# Altium project Sampler.PrjPCB (part 1 of 3)
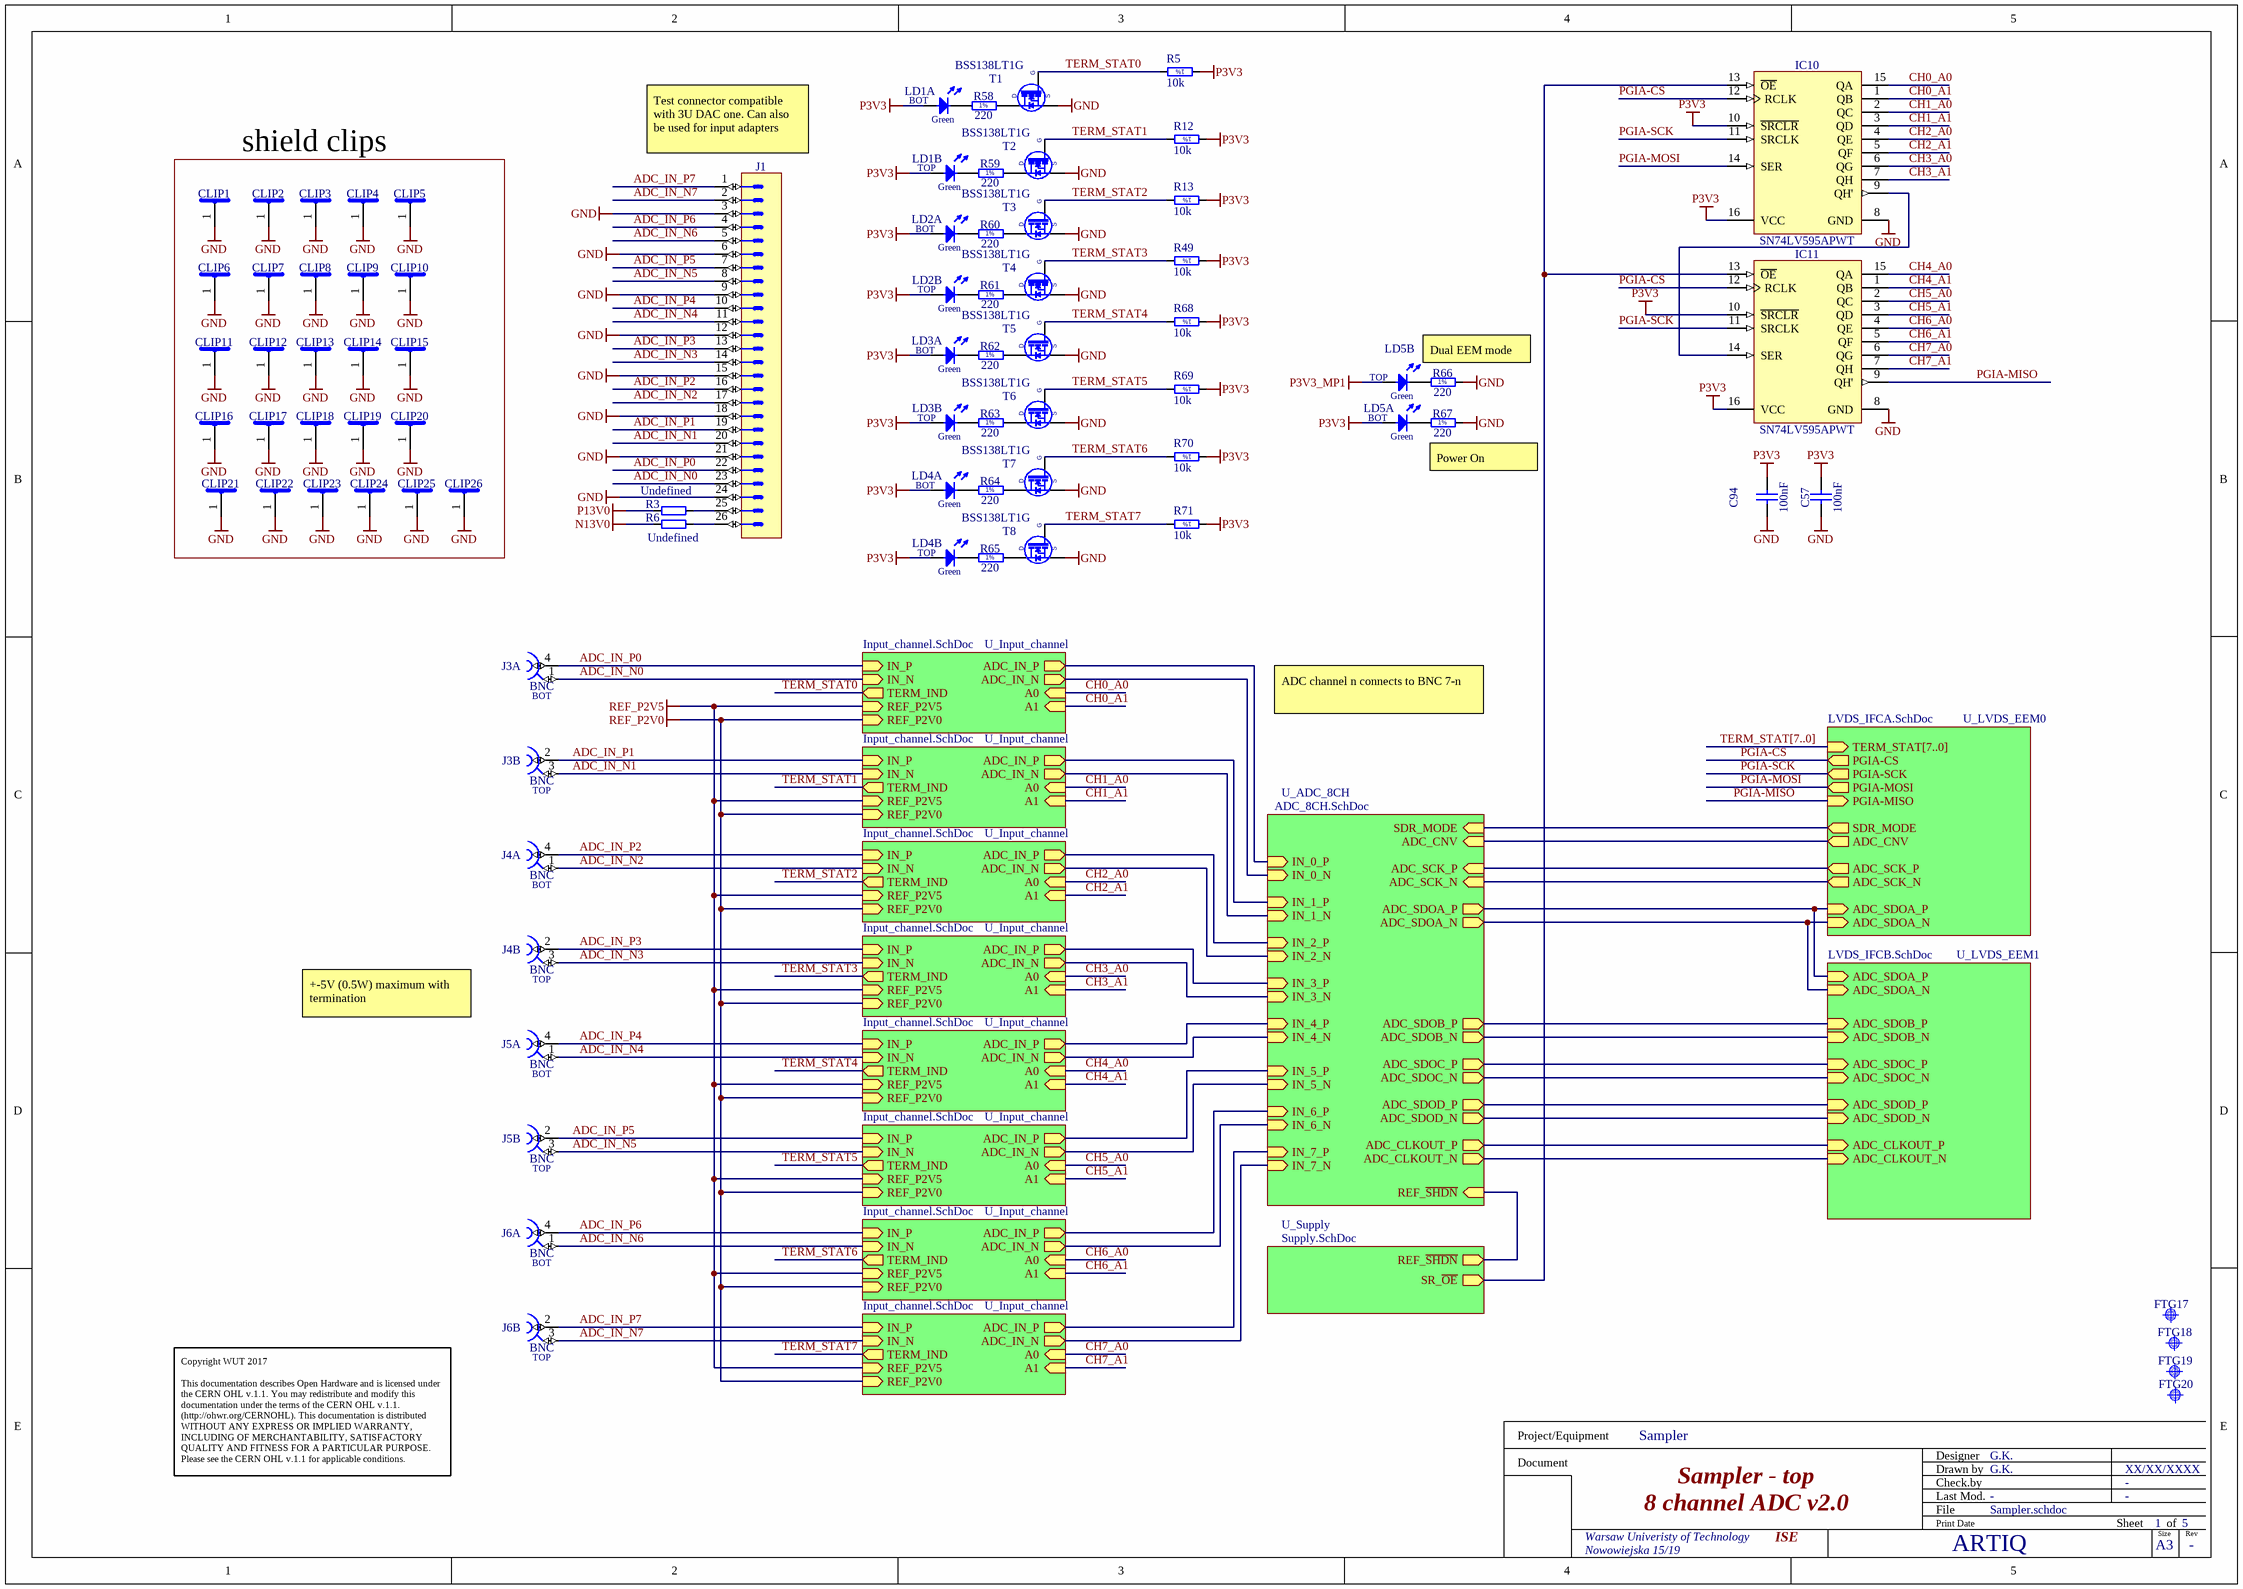
[diagram p0: Sampler.schdoc]
6 sheets, 530 parts. Net scope: hierarchical (ports join the sheet entries above them; power ports are global).
Board file: Sampler.PCBDOC
Sheets:
  Sampler.schdoc
    U_ADC_8CH = ADC_8CH.SchDoc
    U_LVDS_EEM0 = LVDS_IFCA.SchDoc
    U_Supply = Supply.SchDoc
    U_LVDS_EEM1 = LVDS_IFCB.SchDoc
    U_Input_channel = Input_channel.SchDoc
    U_Input_channel = Input_channel.SchDoc
    U_Input_channel = Input_channel.SchDoc
    U_Input_channel = Input_channel.SchDoc
    U_Input_channel = Input_channel.SchDoc
    U_Input_channel = Input_channel.SchDoc
    U_Input_channel = Input_channel.SchDoc
    U_Input_channel = Input_channel.SchDoc

## Sheet Sampler.schdoc: Sampler - top
size 420 x 297 mm; Author: G.K.; CompanyName: WUT; DrawnBy: G.K.; Organization: CERN; Address1: Warsaw Univeristy of Technology; Address2: Nowowiejska 15/19; DocumentNumber: 1; Revision: -; SheetNumber: 1; SheetTotal: 5; EDA_Number: ARTIQ; Projet: Sampler; ModifiedBy: -; CreateDate: XX/XX/XXXX; CheckedDate: -; Title2: 8 channel ADC v2.0; DivGrp: ISE; Designer: G.K.; ModifiedDate: -; ProjectName: Sampler

### Parts
C57  100nF  [CAPC1608X87N]
C94  100nF  [CAPC1608X87N]
CLIP1  S1411-46R  [CLIP_HOLLAND-SHIELDING_LC]  (value not drawn)
CLIP2  S1411-46R  [CLIP_HOLLAND-SHIELDING_LC]  (value not drawn)
CLIP3  S1411-46R  [CLIP_HOLLAND-SHIELDING_LC]  (value not drawn)
CLIP4  S1411-46R  [CLIP_HOLLAND-SHIELDING_LC]  (value not drawn)
CLIP5  S1411-46R  [CLIP_HOLLAND-SHIELDING_LC]  (value not drawn)
CLIP6  S1411-46R  [CLIP_HOLLAND-SHIELDING_LC]  (value not drawn)
CLIP7  S1411-46R  [CLIP_HOLLAND-SHIELDING_LC]  (value not drawn)
CLIP8  S1411-46R  [CLIP_HOLLAND-SHIELDING_LC]  (value not drawn)
CLIP9  S1411-46R  [CLIP_HOLLAND-SHIELDING_LC]  (value not drawn)
CLIP10  S1411-46R  [CLIP_HOLLAND-SHIELDING_LC]  (value not drawn)
CLIP11  S1411-46R  [CLIP_HOLLAND-SHIELDING_LC]  (value not drawn)
CLIP12  S1411-46R  [CLIP_HOLLAND-SHIELDING_LC]  (value not drawn)
CLIP13  S1411-46R  [CLIP_HOLLAND-SHIELDING_LC]  (value not drawn)
CLIP14  S1411-46R  [CLIP_HOLLAND-SHIELDING_LC]  (value not drawn)
CLIP15  S1411-46R  [CLIP_HOLLAND-SHIELDING_LC]  (value not drawn)
CLIP16  S1411-46R  [CLIP_HOLLAND-SHIELDING_LC]  (value not drawn)
CLIP17  S1411-46R  [CLIP_HOLLAND-SHIELDING_LC]  (value not drawn)
CLIP18  S1411-46R  [CLIP_HOLLAND-SHIELDING_LC]  (value not drawn)
CLIP19  S1411-46R  [CLIP_HOLLAND-SHIELDING_LC]  (value not drawn)
CLIP20  S1411-46R  [CLIP_HOLLAND-SHIELDING_LC]  (value not drawn)
CLIP21  S1411-46R  [CLIP_HOLLAND-SHIELDING_LC]  (value not drawn)
CLIP22  S1411-46R  [CLIP_HOLLAND-SHIELDING_LC]  (value not drawn)
CLIP23  S1411-46R  [CLIP_HOLLAND-SHIELDING_LC]  (value not drawn)
CLIP24  S1411-46R  [CLIP_HOLLAND-SHIELDING_LC]  (value not drawn)
CLIP25  S1411-46R  [CLIP_HOLLAND-SHIELDING_LC]  (value not drawn)
CLIP26  S1411-46R  [CLIP_HOLLAND-SHIELDING_LC]  (value not drawn)
FTG17  Use only in PCB  [FIDUCIAL_TOP_C100-200]  (value not drawn)
FTG18  Use only in PCB  [FIDUCIAL_TOP_S100-200]  (value not drawn)
FTG19  Use only in PCB  [FIDUCIAL_TOP_S200-400]  (value not drawn)
FTG20  Use only in PCB  [FIDUCIAL_TOP_S100-200]  (value not drawn)
IC10  SN74LV595APWT  [SOP65P640X120-16N]
IC11  SN74LV595APWT  [SOP65P640X120-16N]
J1  Header 26  [3M_N2526-6002RB]  (value not drawn)
J3  BNC  [RENHOTEC_RHT-610-0049]  (parts A,B of 2)
J4  BNC  [RENHOTEC_RHT-610-0049]  (parts A,B of 2)
J5  BNC  [RENHOTEC_RHT-610-0049]  (parts A,B of 2)
J6  BNC  [RENHOTEC_RHT-610-0049]  (parts A,B of 2)
LD1  Green/Green  [LED_DIALIGHT_571-0122F]  (value not drawn)  (parts A,B of 2)
LD2  Green/Green  [LED_DIALIGHT_571-0122F]  (value not drawn)  (parts A,B of 2)
LD3  Green/Green  [LED_DIALIGHT_571-0122F]  (value not drawn)  (parts A,B of 2)
LD4  Green/Green  [LED_DIALIGHT_571-0122F]  (value not drawn)  (parts A,B of 2)
LD5  Green/Green  [LED_DIALIGHT_571-0122F]  (value not drawn)  (parts A,B of 2)
R3  Undefined  [RESC1608X55N]
R5  10k  [RESC1005X40N]
R6  Undefined  [RESC1608X55N]
R12  10k  [RESC1005X40N]
R13  10k  [RESC1005X40N]
R49  10k  [RESC1005X40N]
R58  220  [RESC1608X55N]
R59  220  [RESC1608X55N]
R60  220  [RESC1608X55N]
R61  220  [RESC1608X55N]
R62  220  [RESC1608X55N]
R63  220  [RESC1608X55N]
R64  220  [RESC1608X55N]
R65  220  [RESC1608X55N]
R66  220  [RESC1608X55N]
R67  220  [RESC1608X55N]
R68  10k  [RESC1005X40N]
R69  10k  [RESC1005X40N]
R70  10k  [RESC1005X40N]
R71  10k  [RESC1005X40N]
T1  BSS138LT1G  [SOT95P240X110-3N]
T2  BSS138LT1G  [SOT95P240X110-3N]
T3  BSS138LT1G  [SOT95P240X110-3N]
T4  BSS138LT1G  [SOT95P240X110-3N]
T5  BSS138LT1G  [SOT95P240X110-3N]
T6  BSS138LT1G  [SOT95P240X110-3N]
T7  BSS138LT1G  [SOT95P240X110-3N]
T8  BSS138LT1G  [SOT95P240X110-3N]

### Blocks framed on the sheet
shield clips: CLIP1-CLIP26

### Sub-sheets
U_ADC_8CH = ADC_8CH.SchDoc: IN_1_P (in), IN_2_P (in), IN_0_P (in), IN_3_P (in), IN_4_P (in), IN_5_P (in), IN_6_P (in), IN_7_P (in), IN_0_N (in), IN_1_N (in), IN_2_N (in), IN_3_N (in), IN_6_N (in), IN_7_N (in), IN_4_N (in), IN_5_N (in), ADC_SDOA_P (out), ADC_SDOA_N (out), ADC_SCK_P (in), ADC_SCK_N (in), ADC_CNV (in), ADC_SDOB_N (out), ADC_SDOB_P (out), ADC_SDOC_P (out), ADC_SDOC_N (out), ADC_SDOD_N (out), ADC_SDOD_P (out), ADC_CLKOUT_P (out), ADC_CLKOUT_N (out), SDR_MODE (in), REF_~{SHDN} (in)
U_Input_channel = Input_channel.SchDoc: IN_N (in), A0 (in), A1 (in), IN_P (in), TERM_IND (out), ADC_IN_N (out), ADC_IN_P (out), REF_P2V5 (in), REF_P2V0 (in)
U_Input_channel = Input_channel.SchDoc: IN_N (in), A0 (in), A1 (in), IN_P (in), TERM_IND (out), ADC_IN_N (out), ADC_IN_P (out), REF_P2V5 (in), REF_P2V0 (in)
U_Input_channel = Input_channel.SchDoc: IN_N (in), A0 (in), A1 (in), IN_P (in), TERM_IND (out), ADC_IN_N (out), ADC_IN_P (out), REF_P2V5 (in), REF_P2V0 (in)
U_Input_channel = Input_channel.SchDoc: IN_N (in), A0 (in), A1 (in), IN_P (in), TERM_IND (out), ADC_IN_N (out), ADC_IN_P (out), REF_P2V5 (in), REF_P2V0 (in)
U_Input_channel = Input_channel.SchDoc: IN_N (in), A0 (in), A1 (in), IN_P (in), TERM_IND (out), ADC_IN_N (out), ADC_IN_P (out), REF_P2V5 (in), REF_P2V0 (in)
U_Input_channel = Input_channel.SchDoc: IN_N (in), A0 (in), A1 (in), IN_P (in), TERM_IND (out), ADC_IN_N (out), ADC_IN_P (out), REF_P2V5 (in), REF_P2V0 (in)
U_Input_channel = Input_channel.SchDoc: IN_N (in), A0 (in), A1 (in), IN_P (in), TERM_IND (out), ADC_IN_N (out), ADC_IN_P (out), REF_P2V5 (in), REF_P2V0 (in)
U_Input_channel = Input_channel.SchDoc: IN_N (in), A0 (in), A1 (in), IN_P (in), TERM_IND (out), ADC_IN_N (out), ADC_IN_P (out), REF_P2V5 (in), REF_P2V0 (in)
U_LVDS_EEM0 = LVDS_IFCA.SchDoc: TERM_STAT[7..0] (in), PGIA-CS (out), PGIA-SCK (out), PGIA-MOSI (out), PGIA-MISO (in), ADC_SDOA_N (in), ADC_SDOA_P (in), ADC_SCK_N (out), ADC_SCK_P (out), ADC_CNV (out), SDR_MODE (out)
U_LVDS_EEM1 = LVDS_IFCB.SchDoc: ADC_SDOB_P (in), ADC_SDOB_N (in), ADC_SDOC_P (in), ADC_SDOC_N (in), ADC_SDOD_P (in), ADC_SDOD_N (in), ADC_CLKOUT_P (in), ADC_CLKOUT_N (in), ADC_SDOA_N (in), ADC_SDOA_P (in)
U_Supply = Supply.SchDoc: REF_~{SHDN} (out), SR_~{OE} (out)

### Nets
GND: C57.1 C94.1 CLIP1.1 CLIP2.1 CLIP3.1 CLIP4.1 CLIP5.1 CLIP6.1 CLIP7.1 CLIP8.1 CLIP9.1 CLIP10.1 CLIP11.1 CLIP12.1 CLIP13.1 CLIP14.1 CLIP15.1 CLIP16.1 CLIP17.1 CLIP18.1 CLIP19.1 CLIP20.1 CLIP21.1 CLIP22.1 CLIP23.1 CLIP24.1 CLIP25.1 CLIP26.1 IC10.8(GND) IC11.8(GND) J1.3 J1.6 J1.9 J1.12 J1.15 J1.18 J1.21 J1.24 R66.2 R67.2 T1.2(S) T2.2(S) T3.2(S) T4.2(S) T5.2(S) T6.2(S) T7.2(S) T8.2(S)
N13V0: R6.2
P3V3: C57.2 C94.2 IC10.10(~{SRCLR}) IC10.16(VCC) IC11.10(~{SRCLR}) IC11.16(VCC) LD1.2(A) LD1.4(A) LD2.2(A) LD2.4(A) LD3.2(A) LD3.4(A) LD4.2(A) LD4.4(A) LD5.2(A) R5.1 R12.1 R13.1 R49.1 R68.1 R69.1 R70.1 R71.1
P3V3_MP1: LD5.4(A)
P13V0: R3.2
REF_P2V0: sheet U_Input_channel/REF_P2V0, sheet U_Input_channel/REF_P2V0, sheet U_Input_channel/REF_P2V0, sheet U_Input_channel/REF_P2V0, sheet U_Input_channel/REF_P2V0, sheet U_Input_channel/REF_P2V0, sheet U_Input_channel/REF_P2V0, sheet U_Input_channel/REF_P2V0
REF_P2V5: sheet U_Input_channel/REF_P2V5, sheet U_Input_channel/REF_P2V5, sheet U_Input_channel/REF_P2V5, sheet U_Input_channel/REF_P2V5, sheet U_Input_channel/REF_P2V5, sheet U_Input_channel/REF_P2V5, sheet U_Input_channel/REF_P2V5, sheet U_Input_channel/REF_P2V5
ADC_CLKOUT_N: sheet U_ADC_8CH/ADC_CLKOUT_N, sheet U_LVDS_EEM1/ADC_CLKOUT_N
ADC_CLKOUT_P: sheet U_ADC_8CH/ADC_CLKOUT_P, sheet U_LVDS_EEM1/ADC_CLKOUT_P
ADC_IN_N0: J1.23 J3.1 ; sheet U_Input_channel/IN_N
ADC_IN_N1: J1.20 J3.3 ; sheet U_Input_channel/IN_N
ADC_IN_N2: J1.17 J4.1 ; sheet U_Input_channel/IN_N
ADC_IN_N3: J1.14 J4.3 ; sheet U_Input_channel/IN_N
ADC_IN_N4: J1.11 J5.1 ; sheet U_Input_channel/IN_N
ADC_IN_N5: J1.8 J5.3 ; sheet U_Input_channel/IN_N
ADC_IN_N6: J1.5 J6.1 ; sheet U_Input_channel/IN_N
ADC_IN_N7: J1.2 J6.3 ; sheet U_Input_channel/IN_N
ADC_IN_P0: J1.22 J3.4 ; sheet U_Input_channel/IN_P
ADC_IN_P1: J1.19 J3.2 ; sheet U_Input_channel/IN_P
ADC_IN_P2: J1.16 J4.4 ; sheet U_Input_channel/IN_P
ADC_IN_P3: J1.13 J4.2 ; sheet U_Input_channel/IN_P
ADC_IN_P4: J1.10 J5.4 ; sheet U_Input_channel/IN_P
ADC_IN_P5: J1.7 J5.2 ; sheet U_Input_channel/IN_P
ADC_IN_P6: J1.4 J6.4 ; sheet U_Input_channel/IN_P
ADC_IN_P7: J1.1 J6.2 ; sheet U_Input_channel/IN_P
ADC_SCK_N: sheet U_ADC_8CH/ADC_SCK_N, sheet U_LVDS_EEM0/ADC_SCK_N
ADC_SCK_P: sheet U_ADC_8CH/ADC_SCK_P, sheet U_LVDS_EEM0/ADC_SCK_P
ADC_SDOA_N: sheet U_ADC_8CH/ADC_SDOA_N, sheet U_LVDS_EEM0/ADC_SDOA_N, sheet U_LVDS_EEM1/ADC_SDOA_N
ADC_SDOA_P: sheet U_ADC_8CH/ADC_SDOA_P, sheet U_LVDS_EEM0/ADC_SDOA_P, sheet U_LVDS_EEM1/ADC_SDOA_P
ADC_SDOB_N: sheet U_ADC_8CH/ADC_SDOB_N, sheet U_LVDS_EEM1/ADC_SDOB_N
ADC_SDOB_P: sheet U_ADC_8CH/ADC_SDOB_P, sheet U_LVDS_EEM1/ADC_SDOB_P
ADC_SDOC_N: sheet U_ADC_8CH/ADC_SDOC_N, sheet U_LVDS_EEM1/ADC_SDOC_N
ADC_SDOC_P: sheet U_ADC_8CH/ADC_SDOC_P, sheet U_LVDS_EEM1/ADC_SDOC_P
ADC_SDOD_N: sheet U_ADC_8CH/ADC_SDOD_N, sheet U_LVDS_EEM1/ADC_SDOD_N
ADC_SDOD_P: sheet U_ADC_8CH/ADC_SDOD_P, sheet U_LVDS_EEM1/ADC_SDOD_P
CH0_A0: IC10.15(QA) ; sheet U_Input_channel/A0
CH0_A1: IC10.1(QB) ; sheet U_Input_channel/A1
CH1_A0: IC10.2(QC) ; sheet U_Input_channel/A0
CH1_A1: IC10.3(QD) ; sheet U_Input_channel/A1
CH2_A0: IC10.4(QE) ; sheet U_Input_channel/A0
CH2_A1: IC10.5(QF) ; sheet U_Input_channel/A1
CH3_A0: IC10.6(QG) ; sheet U_Input_channel/A0
CH3_A1: IC10.7(QH) ; sheet U_Input_channel/A1
CH4_A0: IC11.15(QA) ; sheet U_Input_channel/A0
CH4_A1: IC11.1(QB) ; sheet U_Input_channel/A1
CH5_A0: IC11.2(QC) ; sheet U_Input_channel/A0
CH5_A1: IC11.3(QD) ; sheet U_Input_channel/A1
CH6_A0: IC11.4(QE) ; sheet U_Input_channel/A0
CH6_A1: IC11.5(QF) ; sheet U_Input_channel/A1
CH7_A0: IC11.6(QG) ; sheet U_Input_channel/A0
CH7_A1: IC11.7(QH) ; sheet U_Input_channel/A1
IN_0_N: sheet U_ADC_8CH/IN_0_N, sheet U_Input_channel/ADC_IN_N
IN_0_P: sheet U_ADC_8CH/IN_0_P, sheet U_Input_channel/ADC_IN_P
IN_1_N: sheet U_ADC_8CH/IN_1_N, sheet U_Input_channel/ADC_IN_N
IN_1_P: sheet U_ADC_8CH/IN_1_P, sheet U_Input_channel/ADC_IN_P
IN_2_N: sheet U_ADC_8CH/IN_2_N, sheet U_Input_channel/ADC_IN_N
IN_2_P: sheet U_ADC_8CH/IN_2_P, sheet U_Input_channel/ADC_IN_P
IN_3_N: sheet U_ADC_8CH/IN_3_N, sheet U_Input_channel/ADC_IN_N
IN_3_P: sheet U_ADC_8CH/IN_3_P, sheet U_Input_channel/ADC_IN_P
IN_4_N: sheet U_ADC_8CH/IN_4_N, sheet U_Input_channel/ADC_IN_N
IN_4_P: sheet U_ADC_8CH/IN_4_P, sheet U_Input_channel/ADC_IN_P
IN_5_N: sheet U_ADC_8CH/IN_5_N, sheet U_Input_channel/ADC_IN_N
IN_5_P: sheet U_ADC_8CH/IN_5_P, sheet U_Input_channel/ADC_IN_P
IN_6_N: sheet U_ADC_8CH/IN_6_N, sheet U_Input_channel/ADC_IN_N
IN_6_P: sheet U_ADC_8CH/IN_6_P, sheet U_Input_channel/ADC_IN_P
IN_7_N: sheet U_ADC_8CH/IN_7_N, sheet U_Input_channel/ADC_IN_N
IN_7_P: sheet U_ADC_8CH/IN_7_P, sheet U_Input_channel/ADC_IN_P
PGIA-CS: IC10.12(RCLK) IC11.12(RCLK) ; sheet U_LVDS_EEM0/PGIA-CS
PGIA-MISO: IC11.9(QH') ; sheet U_LVDS_EEM0/PGIA-MISO
PGIA-MOSI: IC10.14(SER) ; sheet U_LVDS_EEM0/PGIA-MOSI
PGIA-SCK: IC10.11(SRCLK) IC11.11(SRCLK) ; sheet U_LVDS_EEM0/PGIA-SCK
TERM_STAT0: R5.2 T1.1(G) ; sheet U_Input_channel/TERM_IND
TERM_STAT1: R12.2 T2.1(G) ; sheet U_Input_channel/TERM_IND
TERM_STAT2: R13.2 T3.1(G) ; sheet U_Input_channel/TERM_IND
TERM_STAT3: R49.2 T4.1(G) ; sheet U_Input_channel/TERM_IND
TERM_STAT4: R68.2 T5.1(G) ; sheet U_Input_channel/TERM_IND
TERM_STAT5: R69.2 T6.1(G) ; sheet U_Input_channel/TERM_IND
TERM_STAT6: R70.2 T7.1(G) ; sheet U_Input_channel/TERM_IND
TERM_STAT7: R71.2 T8.1(G) ; sheet U_Input_channel/TERM_IND
NetD6_1: sheet U_ADC_8CH/REF_~{SHDN}, sheet U_Supply/REF_~{SHDN}
NetIC2_24: sheet U_ADC_8CH/ADC_CNV, sheet U_LVDS_EEM0/ADC_CNV
NetIC10_9: IC10.9(QH') IC11.14(SER)
NetIC10_13: IC10.13(~{OE}) IC11.13(~{OE}) ; sheet U_Supply/SR_~{OE}
NetIC24_5: sheet U_ADC_8CH/SDR_MODE, sheet U_LVDS_EEM0/SDR_MODE
NetJ1_25: J1.25 R3.1
NetJ1_26: J1.26 R6.1
NetLD1_1: LD1.1(C) R58.1
NetLD1_3: LD1.3(C) R59.1
NetLD2_1: LD2.1(C) R60.1
NetLD2_3: LD2.3(C) R61.1
NetLD3_1: LD3.1(C) R62.1
NetLD3_3: LD3.3(C) R63.1
NetLD4_1: LD4.1(C) R64.1
NetLD4_3: LD4.3(C) R65.1
NetLD5_1: LD5.1(C) R67.1
NetLD5_3: LD5.3(C) R66.1
NetR58_2: R58.2 T1.3(D)
NetR59_2: R59.2 T2.3(D)
NetR60_2: R60.2 T3.3(D)
NetR61_2: R61.2 T4.3(D)
NetR62_2: R62.2 T5.3(D)
NetR63_2: R63.2 T6.3(D)
NetR64_2: R64.2 T7.3(D)
NetR65_2: R65.2 T8.3(D)

### Buses and harness runs
bus TERM_STAT[7..0] = sheet U_LVDS_EEM0/TERM_STAT[7..0]

### Notes on the sheet
- (near J1) Test connector compatible with 3U DAC one. Can also be used for input adapters
- Dual EEM mode
- Power On
- ADC channel n connects to BNC 7-n
- +-5V (0.5W) maximum with termination
- Copyright WUT 2017
  This documentation describes Open Hardware and is licensed under the CERN OHL v.1.1. You may redistribute and modify this documentation under the terms of the CERN OHL v.1.1. (http://ohwr.org/CERNOHL). This documentation is distributed WITHOUT ANY EXPRESS OR IMPLIED WARRANTY, INCLUDING OF MERCHANTABILITY, SATISFACTORY QUALITY AND FITNESS FOR A PARTICULAR PURPOSE. Please see the CERN OHL v.1.1 for applicable conditions.
- Project/Equipment
- Document
- Designer
- Drawn by
- Check.by
- File
- Last Mod.
- Print Date
- Sheet
- Size
- A3
- of
- Rev
- (in symbol CON_BNC_DUAL, part A) BOT
- (in symbol CON_BNC_DUAL, part B) TOP
- (in symbol LED_DIALIGHT_571-0122F, part A) BOT; Green
- (in symbol LED_DIALIGHT_571-0122F, part B) TOP; Green
- (in symbol R0402_10K_1%_0.0625W_100PPM) 1%
- (in symbol R0603_220R_1%_0.1W_100PPM) 1%

### Library data of the parts
C57 C94 = CC0603_100NF_50V_10%_X7R: Non-polarised capacitor; Part Description: SMD Multilayer Chip Ceramic Capacitor; Manufacturer: GENERIC; Manufacturer1 Part Number: 223858615649; Voltage: 50V; TC: X7R; Tolerance: ±10%; Part Number: CC0603_100NF_50V_10%_X7R; Component Kind: Standard; Component Type: Standard; Pin Count: 2; Value: 100nF; Status: Preferred; Manufacturer Part Number: CC0603_100NF_50V_10%_X7R; Case: 0603; Mounted: Yes; Socket: No; SMD: Yes; Sense: No; Manufacturer1 Example: PHYCOMP; Manufacturer1 ComponentHeight: 0.87mm; HelpURL: \\cern.ch\dfs\Applications\Altium\Datasheets\CC0603_X7R_PHYCOMP.pdf; Author: CERN DEM JLC; CreateDate: 03.12.2007; LatestRevisionDate: 03.12.2007
CLIP1-CLIP26 = SHIELD_CLIP: Surface Mount Clip for PCB Screening Covers; Part Description: Surface Mount Clip for PCB Screening Covers, 1500 Serie; Manufacturer: HARWIN; PressFit: No; Table: Metal Screening Box; Part Number: S1411-46R; Component Kind: Standard; Component Type: Standard; Pin Count: 1; PackageDescription: Surface Mount Clip for PCB Screening Covers, 1500 Serie; Mounted: Yes; Socket: No; SMD: Yes; Status: None; Manufacturer Part Number: S1411-46R; ComponentHeight: 3.5mm; HelpURL: \\cern.ch\dfs\Applications\Altium\Datasheets\CLIP_HOLLAND-SHIELDING_LC.pdf; Author: CERN DEM JLC; CreateDate: 2013-06-25; LatestRevisionDate: 2013-06-25
FTG17 = FIDUCIAL_TARGET_C100-200: Fiducial Target; Part Description: Round Fiducial Target, Top Layer, 1.0mm, Top Solder 2.0mm, Keepout =2.0mm; Mounted: No; Part Number: FIDUCIAL_TARGET_C100-200; Component Kind: Standard (No BOM); Component Type: Standard (No BOM); Pin Count: 1; Family: Fiducial; Socket: No; SMD: Yes; Sense: No; Status: None; ComponentHeight: 0mm; HelpURL: Undefined; Author: CERN DEM JLC; CreateDate: 09.02.2010; LatestRevisionDate: 04.04.2012; PackageDescription: Round Fiducial Target, Top Layer, 1.0mm, Top Solder 2.0mm, Keepout =2.0mm
FTG18 FTG20 = FIDUCIAL_TARGET_S100-200: Fiducial Target; Part Description: Square Fiducial Target, Top Layer, 1.0mm, Top Solder 2.0mm, Keepout =2.0mm; Mounted: No; Part Number: FIDUCIAL_TARGET_S100-200; Component Kind: Standard (No BOM); Component Type: Standard (No BOM); Pin Count: 1; Family: Fiducial; Socket: No; SMD: Yes; Sense: No; Status: None; ComponentHeight: 0mm; HelpURL: Undefined; Author: CERN DEM JLC; CreateDate: 09.02.2010; LatestRevisionDate: 04.04.2012; PackageDescription: Square Fiducial Target, Top Layer, 1.0mm, Top Solder 2.0mm, Keepout =2.0mm
FTG19 = FIDUCIAL_TARGET_S200-400: Fiducial Target; Part Description: Square Fiducial Target, Top Layer, 2.0mm, Top Solder 4.0mm, Keepout =4.0mm; Mounted: No; Part Number: FIDUCIAL_TARGET_S200-400; Component Kind: Standard (No BOM); Component Type: Standard (No BOM); Pin Count: 1; Family: Fiducial; Socket: No; SMD: Yes; Sense: No; Status: None; ComponentHeight: 0mm; HelpURL: Undefined; Author: CERN DEM JLC; CreateDate: 02.06.2008; LatestRevisionDate: 04.04.2012; PackageDescription: Square Fiducial Target, Top Layer, 2.0mm, Top Solder 4.0mm, Keepout =4.0mm
IC10 IC11 = SN74LV595APWT: 8-Bit Shift Register With 3-State Output Register; Manufacturer: TEXAS INSTRUMENTS; PressFit: No; Bonding: No; Part Number: SN74LV595APWT; Component Kind: Standard; Component Type: Standard; Device: SN74LV595APWT; PackageDescription: SOP, 0.65mm pitch; 16 pin, 4.40mm W X 5.00mm L X 1.20mm H body IPC Medium Density; Part Description: 8-Bit Shift Register With 3-State Output Register; Manufacturer Part Number: SN74LV595APWT; Pin Count: 16; Case: TSSOP16; Mounted: Yes; Socket: No; SMD: Yes; Sense: No; ComponentHeight: 1.2mm; Author: CERN DEM JLC; HelpURL: \\cern.ch\dfs\Applications\Altium\Datasheets\SN74LV595APWT.pdf; CreateDate: 10.05.2012; LatestRevisionDate: 10.05.2012
J1 = 3M_N2526-6002RB: Connector 26 Male; Part Description: 26 Contacts - Straight .100'' x .100'' Low Profile Four-Wall Header, 2500 Series; Manufacturer: 3M; PressFit: No; Part Number: 3M_N2526-6002RB; Component Kind: Standard; Component Type: Standard; Pin Count: 26; Family: Header 26; Mounted: Yes; Socket: No; SMD: No; Sense: No; Status: None; Manufacturer Part Number: N2526-6002RB; ComponentHeight: 10.03mm; HelpURL: \\cern.ch\dfs\Applications\Altium\Datasheets\3M_N2526-6002RB.pdf; Author: CERN DEM JLC; CreateDate: 11.02.2009; LatestRevisionDate: 11.08.2009
J3-J6 = CON_BNC_DUAL: Dual Right Angle 50 Ohm BNC Jack, White Valox Case; Manufacturer: RENHOTEC; Manufacturer Part Number: RHT-610-0049; PressFit: No; Part Number: RENHOTEC_RHT-610-0049; Component Kind: Standard; Component Type: Standard; Pin Count: 6; Family: BNC; Mounted: Yes; Socket: No; SMD: No; Sense: No; Status: None; Part Description: Dual Right Angle 50 Ohm BNC Jack, White Valox Case; ComponentHeight: 29.3mm; HelpURL: \\cern.ch\dfs\Applications\Altium\Datasheets\BOMAR_364A2595.pdf; Author: GK; CreateDate: 09.04.2013; LatestRevisionDate: 09.04.2013
LD1-LD5 = LED_DIALIGHT_571-0122F: LED x2 Green 1C2A-BOT_3C4A-TOP; Part Description: Dual 2mm Green LEDs CBI® Circuit Board Indicator (Without positioning pins); PressFit: No; Bonding: No; Part Number: LED_DIALIGHT_571-0122F; Component Kind: Standard; Component Type: Standard; Color: Green/Green; PackageDescription: 2x 2mm Red LED PCB Edge Mounting (Without positioning pins) DIALIGHT 571 Serie; Manufacturer: DIALIGHT; Manufacturer Part Number: 571-0122F; Pin Count: 4; Mounted: Yes; Socket: No; SMD: No; Sense: No; ComponentHeight: 8.6mm; HelpURL: \\cern.ch\dfs\Applications\Altium\Datasheets\LED_DIALIGHT_571-0122F.pdf; Author: CERN DEM JLC; CreateDate: 09.11.2009; LatestRevisionDate: 17.03.2010
R3 R6 = R0603_NO-VALUE: Resistor; Part Description: Reserved Footprint For a 0603 (1608) Chip Resistor; Mounted: No; Part Number: R0603_NO-VALUE; Component Kind: Standard; Component Type: Standard; Pin Count: 2; Value: Undefined; Status: None; Manufacturer: Undefined; Manufacturer Part Number: R0603_NO-VALUE; Case: 0603; Sense: No; Socket: No; SMD: Yes; Manufacturer1 Example: Undefined; Manufacturer1 Part Number: Undefined; Manufacturer1 ComponentHeight: Undefined; HelpURL: Undefined; Author: CERN DEM JLC; CreateDate: 03.12.2007; LatestRevisionDate: 13.03.2008
R5 R12 R13 R49 R68-R71 = R0402_10K_1%_0.0625W_100PPM: Resistor - 1%; Part Description: General Purpose Thick Film Chip Resistor; Manufacturer: GENERIC; Manufacturer1 Part Number: 232270671003L; TC: ±100ppm/°C; Part Number: R0402_10K_1%_0.0625W_100PPM; Component Kind: Standard; Component Type: Standard; Pin Count: 2; Value: 10k; Status: Not recommended; Power: 0.0625W; Tolerance: ±1%; Manufacturer Part Number: R0402_10K_1%_0.0625W_100PPM; Case: 0402; Mounted: Yes; Sense: No; Socket: No; SMD: Yes; Manufacturer1 Example: YAGEO PHYCOMP; Manufacturer1 ComponentHeight: 0.4mm; HelpURL: \\cern.ch\dfs\Applications\Altium\Datasheets\R0402_Phycomp_RC0402.pdf; Author: CERN DEM JLC; CreateDate: 03.12.2007; LatestRevisionDate: 17.10.2012
R58-R67 = R0603_220R_1%_0.1W_100PPM: Resistor - 1%; Part Description: General Purpose Thick Film Chip Resistor; Manufacturer: GENERIC; Manufacturer1 Part Number: NRC06F2200TRF; Power: 0.1W; TC: ±100ppm/°C; Part Number: R0603_220R_1%_0.1W_100PPM; Component Kind: Standard; Component Type: Standard; Pin Count: 2; Value: 220; Status: Preferred; Tolerance: ±1%; Manufacturer Part Number: R0603_220R_1%_0.1W_100PPM; Case: 0603; Mounted: Yes; Sense: No; Socket: No; SMD: Yes; Manufacturer1 Example: NIC COMPONENT; Manufacturer1 ComponentHeight: 0.55mm; HelpURL: \\cern.ch\dfs\Applications\Altium\Datasheets\R0603_NIC_NRC.pdf; Author: CERN DEM JLC; CreateDate: 03.12.2007; LatestRevisionDate: 13.03.2008
T1-T8 = BSS138LT1G: N-CHANNEL MOSFET WITH DIODE; Part Description: 50V 200mA N-Channel Enhancement Mode Field-Effect Transistor; Manufacturer: ON SEMICONDUCTOR; PressFit: No; Bonding: No; Part Number: BSS138LT1G; Component Kind: Standard; Component Type: Standard; Device: BSS138LT1G; PackageDescription: SOT23 3-Leads, Pitch 0.95mm - Body 1.4x3mm, IPC Medium Density; Manufacturer Part Number: BSS138LT1G; Pin Count: 3; Case: SOT23-3; Mounted: Yes; Socket: No; SMD: Yes; Sense: No; ComponentHeight: 1.11mm; HelpURL: \\cern.ch\dfs\Applications\Altium\Datasheets\BSS138LT1G.pdf; Author: CERN DEM JLC; CreateDate: 23.03.2009; LatestRevisionDate: 23.03.2009

## Sheet ADC_8CH.SchDoc: ADC + reference
size 420 x 297 mm; Author: G.K.; CompanyName: WUT; DrawnBy: G.K.; Organization: CERN; Address1: Warsaw Univeristy of Technology; Address2: Nowowiejska 15/19; DocumentNumber: 2; Revision: -; SheetNumber: 2; SheetTotal: 5; EDA_Number: ARTIQ; Projet: Sampler; ModifiedBy: -; CreateDate: XX/XX/XXXX; CheckedDate: -; Title2: v2.0; DivGrp: ISE; Designer: G.K.; ModifiedDate: -; ProjectName: Sampler
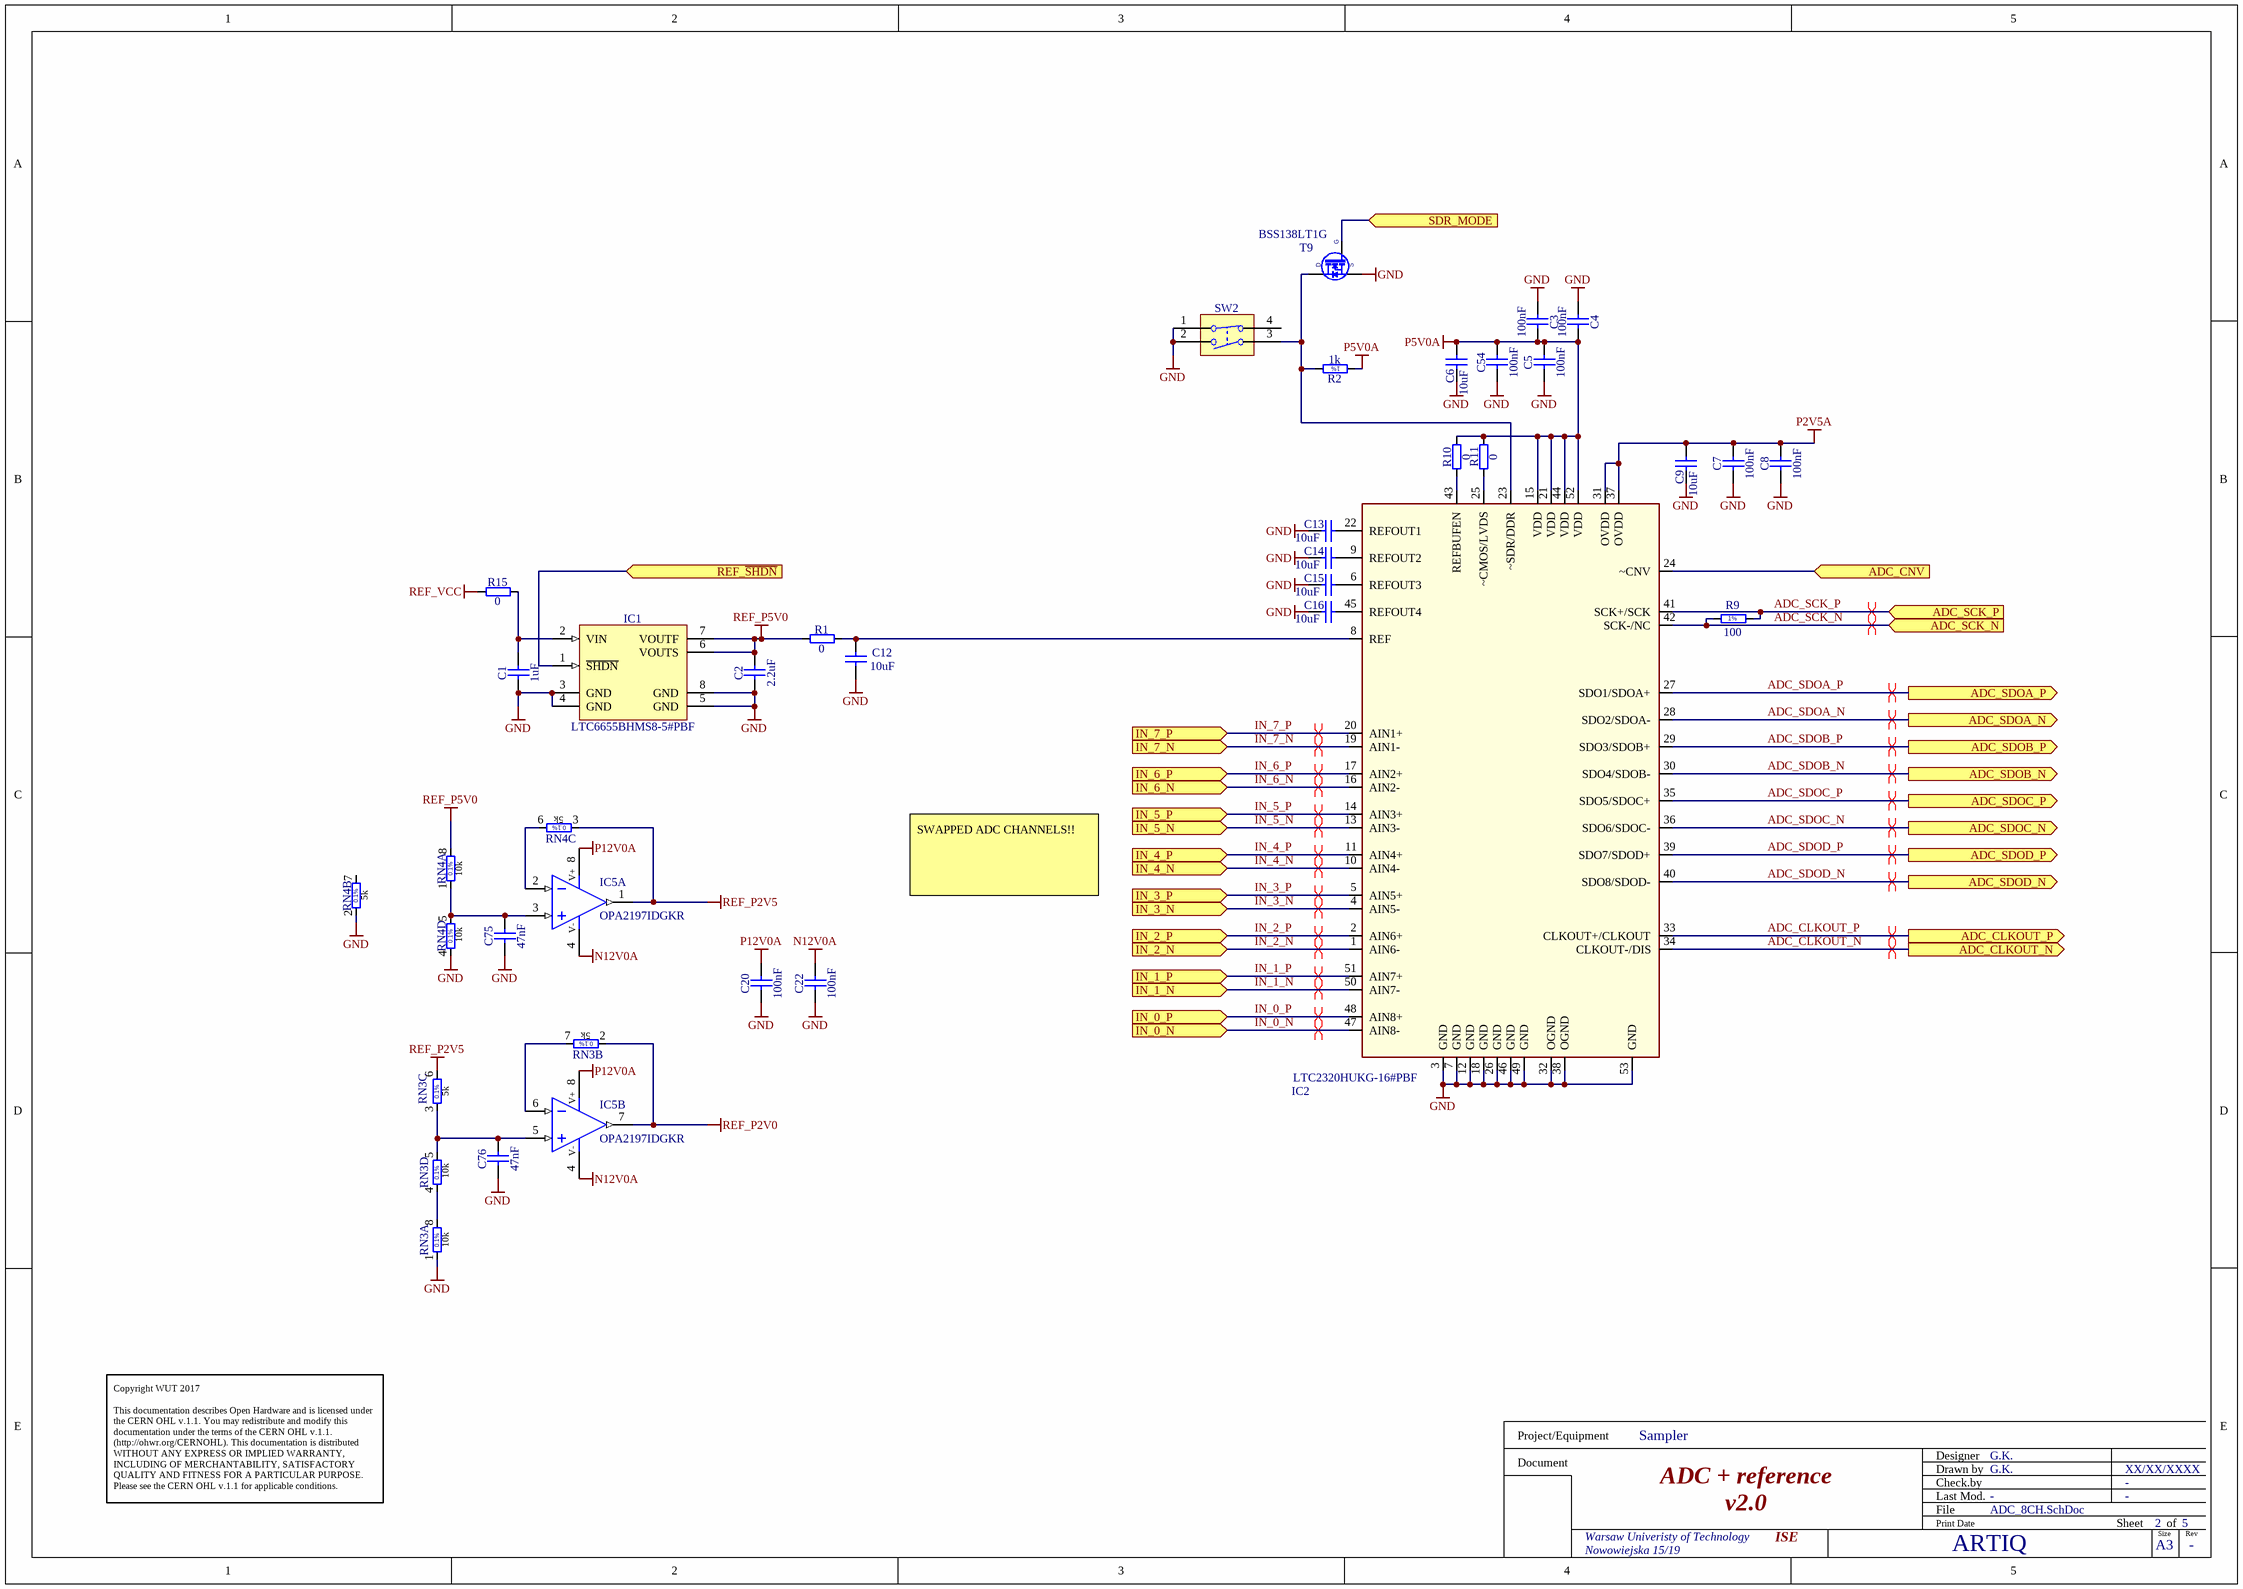
[diagram p1: ADC_8CH.SchDoc]

### Parts
C1  1uF  [CAPC1608X87N]
C2  2.2uF  [CAPC1608X87N]
C3  100nF  [CAPC1608X87N]
C4  100nF  [CAPC1608X87N]
C5  100nF  [CAPC1608X87N]
C6  10uF  [CAPC2012X95N]
C7  100nF  [CAPC1608X87N]
C8  100nF  [CAPC1608X87N]
C9  10uF  [CAPC2012X95N]
C12  10uF  [CAPC2012X95N]
C13  10uF  [CAPC2012X95N]
C14  10uF  [CAPC2012X95N]
C15  10uF  [CAPC2012X95N]
C16  10uF  [CAPC2012X95N]
C20  100nF  [CAPC1005X55N]
C22  100nF  [CAPC1005X55N]
C54  100nF  [CAPC1608X87N]
C75  47nF  [CAPC2012X135N]
C76  47nF  [CAPC2012X135N]
IC1  LTC6655BHMS8-5#PBF  [SOP65P490X110-8N]
IC2  LTC2320HUKG-16#PBF  [QFN50P700X800X80_HS-53M]
IC5  OPA2197IDGKR  [SOP65P490X110-8N]  (parts A,B of 2)
R1  0  [RESC1005X40N]
R2  1k  [RESC1608X55N]
R9  100  [RESC1005X40N]
R10  0  [RESC1005X40N]
R11  0  [RESC1005X40N]
R15  0  [RESC1005X40N]
RN3  10k 5K 5K 10K  [SOIC127P600X175-8N]  (value not drawn)  (parts A,B,C,D of 4)
RN4  10k 5K 5K 10K  [SOIC127P600X175-8N]  (value not drawn)  (parts A,B,C,D of 4)
SW2  Switch  [SW_CTS_204-121ST]  (value not drawn)
T9  BSS138LT1G  [SOT95P240X110-3N]

### Ports
ADC_CLKOUT_N (out), ADC_CLKOUT_P (out), ADC_CNV (in), ADC_SCK_N (in), ADC_SCK_P (in), ADC_SDOA_N (out), ADC_SDOA_P (out), ADC_SDOB_N (out), ADC_SDOB_P (out), ADC_SDOC_N (out), ADC_SDOC_P (out), ADC_SDOD_N (out), ADC_SDOD_P (out), IN_0_N (in), IN_0_P (in), IN_1_N (in), IN_1_P (in), IN_2_N (in), IN_2_P (in), IN_3_N (in), IN_3_P (in), IN_4_N (in), IN_4_P (in), IN_5_N (in), IN_5_P (in), IN_6_N (in), IN_6_P (in), IN_7_N (in), IN_7_P (in), REF_~{SHDN} (in), SDR_MODE (in)

### Nets
GND: C1.1 C2.1 C3.1 C4.1 C5.1 C6.1 C7.1 C8.1 C9.1 C12.1 C13.1 C14.1 C15.1 C16.1 C20.1 C22.1 C54.1 C75.1 C76.1 IC1.3(GND) IC1.4(GND) IC1.5(GND) IC1.8(GND) IC2.3(GND) IC2.7(GND) IC2.12(GND) IC2.18(GND) IC2.26(GND) IC2.32(OGND) IC2.38(OGND) IC2.46(GND) IC2.49(GND) IC2.53(GND) RN3.1 RN4.2 RN4.4 SW2.1 SW2.2 T9.2(S)
N12V0A: C22.2 IC5.4(V-)
P2V5A: C7.2 C8.2 C9.2 IC2.31(OVDD) IC2.37(OVDD)
P5V0A: C3.2 C4.2 C5.2 C6.2 C54.2 IC2.15(VDD) IC2.21(VDD) IC2.44(VDD) IC2.52(VDD) R2.1 R10.2 R11.2
P12V0A: C20.2 IC5.8(V+)
REF_P2V0: IC5.7(OUT) RN3.2
REF_P2V5: IC5.1(OUT) RN3.6 RN4.3
REF_P5V0: C2.2 IC1.6(VOUTS) IC1.7(VOUTF) R1.1 RN4.8
REF_VCC: R15.1
ADC_CLKOUT_N: IC2.34(CLKOUT-/DIS) ; port ADC_CLKOUT_N
ADC_CLKOUT_P: IC2.33(CLKOUT+/CLKOUT) ; port ADC_CLKOUT_P
ADC_SCK_N: IC2.42(SCK-/NC) R9.1 ; port ADC_SCK_N
ADC_SCK_P: IC2.41(SCK+/SCK) R9.2 ; port ADC_SCK_P
ADC_SDOA_N: IC2.28(SDO2/SDOA-) ; port ADC_SDOA_N
ADC_SDOA_P: IC2.27(SDO1/SDOA+) ; port ADC_SDOA_P
ADC_SDOB_N: IC2.30(SDO4/SDOB-) ; port ADC_SDOB_N
ADC_SDOB_P: IC2.29(SDO3/SDOB+) ; port ADC_SDOB_P
ADC_SDOC_N: IC2.36(SDO6/SDOC-) ; port ADC_SDOC_N
ADC_SDOC_P: IC2.35(SDO5/SDOC+) ; port ADC_SDOC_P
ADC_SDOD_N: IC2.40(SDO8/SDOD-) ; port ADC_SDOD_N
ADC_SDOD_P: IC2.39(SDO7/SDOD+) ; port ADC_SDOD_P
IN_0_N: IC2.47(AIN8-) ; port IN_0_N
IN_0_P: IC2.48(AIN8+) ; port IN_0_P
IN_1_N: IC2.50(AIN7-) ; port IN_1_N
IN_1_P: IC2.51(AIN7+) ; port IN_1_P
IN_2_N: IC2.1(AIN6-) ; port IN_2_N
IN_2_P: IC2.2(AIN6+) ; port IN_2_P
IN_3_N: IC2.4(AIN5-) ; port IN_3_N
IN_3_P: IC2.5(AIN5+) ; port IN_3_P
IN_4_N: IC2.10(AIN4-) ; port IN_4_N
IN_4_P: IC2.11(AIN4+) ; port IN_4_P
IN_5_N: IC2.13(AIN3-) ; port IN_5_N
IN_5_P: IC2.14(AIN3+) ; port IN_5_P
IN_6_N: IC2.16(AIN2-) ; port IN_6_N
IN_6_P: IC2.17(AIN2+) ; port IN_6_P
IN_7_N: IC2.19(AIN1-) ; port IN_7_N
IN_7_P: IC2.20(AIN1+) ; port IN_7_P
NetC1_2: C1.2 IC1.2(VIN) R15.2
NetC12_2: C12.2 IC2.8(REF) R1.2
NetC13_2: C13.2 IC2.22(REFOUT1)
NetC14_2: C14.2 IC2.9(REFOUT2)
NetC15_2: C15.2 IC2.6(REFOUT3)
NetC16_2: C16.2 IC2.45(REFOUT4)
NetC75_2: C75.2 IC5.3(IN+) RN4.1 RN4.5
NetC76_2: C76.2 IC5.5(IN+) RN3.3 RN3.5
NetD6_1: IC1.1(~{SHDN}) ; port REF_~{SHDN}
NetIC2_23: IC2.23(~SDR/DDR) R2.2 SW2.3 T9.3(D)
NetIC2_24: IC2.24(~CNV) ; port ADC_CNV
NetIC2_25: IC2.25(~CMOS/LVDS) R11.1
NetIC2_43: IC2.43(REFBUFEN) R10.1
NetIC5_2: IC5.2(IN-) RN4.6
NetIC5_6: IC5.6(IN-) RN3.7
NetIC24_5: T9.1(G) ; port SDR_MODE
NetRN3_4: RN3.4 RN3.8

Not connected (* = marked no-connect by the designer): RN4 7; SW2 4

### Layout directives
differential pair: ADC_CLKOUT_N, ADC_CLKOUT_P, ADC_SCK_N, ADC_SCK_P, ADC_SDOA_N, ADC_SDOA_P, ADC_SDOB_N, ADC_SDOB_P, ADC_SDOC_N, ADC_SDOC_P, ADC_SDOD_N, ADC_SDOD_P, IN_0_N, IN_0_P, IN_1_N, IN_1_P, IN_2_N, IN_2_P, IN_3_N, IN_3_P, IN_4_N, IN_4_P, IN_5_N, IN_5_P, IN_6_N, IN_6_P, IN_7_N, IN_7_P

### Notes on the sheet
- SWAPPED ADC CHANNELS!!
- Copyright WUT 2017
  This documentation describes Open Hardware and is licensed under the CERN OHL v.1.1. You may redistribute and modify this documentation under the terms of the CERN OHL v.1.1. (http://ohwr.org/CERNOHL). This documentation is distributed WITHOUT ANY EXPRESS OR IMPLIED WARRANTY, INCLUDING OF MERCHANTABILITY, SATISFACTORY QUALITY AND FITNESS FOR A PARTICULAR PURPOSE. Please see the CERN OHL v.1.1 for applicable conditions.
- Project/Equipment
- Document
- Designer
- Drawn by
- Check.by
- File
- Last Mod.
- Print Date
- Sheet
- Size
- A3
- of
- Rev
- (in symbol R0402_100R_1%_0.1W_100PPM) 1%
- (in symbol R0603_1K_1%_0.1W_100PPM) 1%
- (in symbol RN_10K_5K_VISHAY_AORN2-1AT3, part A) 10k
- (in symbol RN_10K_5K_VISHAY_AORN2-1AT3, part B) 5k
- (in symbol RN_10K_5K_VISHAY_AORN2-1AT3, part C) 5k
- (in symbol RN_10K_5K_VISHAY_AORN2-1AT3, part D) 10k

### Library data of the parts
C1 = CC0603_1UF_25V_10%_X7R: Non-polarised capacitor; Part Description: SMD Multilayer Chip Ceramic Capacitor; Manufacturer: GENERIC; Manufacturer1 Part Number: GRM188R71E105KA12D; Voltage: 25V; TC: X7R; Tolerance: ±10%; Part Number: CC0603_1UF_25V_10%_X7R; Component Kind: Standard; Component Type: Standard; Pin Count: 2; Value: 1uF; Status: None; Manufacturer Part Number: CC0603_1UF_25V_10%_X7R; Case: 0603; Mounted: Yes; Socket: No; SMD: Yes; Sense: No; Manufacturer1 Example: MURATA; Manufacturer1 ComponentHeight: 0.9mm; HelpURL: \\cern.ch\dfs\Applications\Altium\Datasheets\CC0603_X7R_MURATA.pdf; Author: CERN DEM JLC; CreateDate: 18.01.2011; LatestRevisionDate: 18.01.2011
C2 = CC0603_2.2UF_16V_10%_X5R: Non-polarised capacitor; Part Description: SMD Multilayer Chip Ceramic Capacitor; Manufacturer: GENERIC; Manufacturer1 Part Number: CC0603KRX5R7BB225; Voltage: 16V; TC: X5R; Tolerance: ±10%; Part Number: CC0603_2.2UF_16V_10%_X5R; Component Kind: Standard; Component Type: Standard; Pin Count: 2; Value: 2.2uF; Status: Preferred; Manufacturer Part Number: CC0603_2.2UF_16V_10%_X5R; Case: 0603; Mounted: Yes; Socket: No; SMD: Yes; Sense: No; Manufacturer1 Example: YAGEO; Manufacturer1 ComponentHeight: 0.9mm; HelpURL: \\cern.ch\dfs\Applications\Altium\Datasheets\CC0805_X5R_PHYCOMP_HC.pdf; Author: CERN DEM JLC; CreateDate: 28.04.2011; LatestRevisionDate: 28.04.2011
C3-C5 C7 C8 C54 = CC0603_100NF_50V_10%_X7R: as C57 on sheet Sampler; Part Number: CC0603_100NF_50V_10%_X7R; Component Kind: Standard; Component Type: Standard; Pin Count: 2; Value: 100nF; Status: Preferred; Manufacturer Part Number: CC0603_100NF_50V_10%_X7R; Case: 0603; Mounted: Yes; Socket: No; SMD: Yes; Sense: No; Manufacturer1 Example: PHYCOMP; Manufacturer1 ComponentHeight: 0.87mm; HelpURL: \\cern.ch\dfs\Applications\Altium\Datasheets\CC0603_X7R_PHYCOMP.pdf; Author: CERN DEM JLC; CreateDate: 03.12.2007; LatestRevisionDate: 03.12.2007
C6 C9 C12-C16 = CC0805_10UF_25V_10%_X5R: Non-polarised capacitor; Part Description: SMD Multilayer Chip Ceramic Capacitor; Manufacturer: GENERIC; Manufacturer1 Part Number: GRM219R61E106KA12D; Voltage: 25V; TC: X5R; Tolerance: ±10%; Part Number: CC0805_10UF_25V_10%_X5R; Component Kind: Standard; Component Type: Standard; Pin Count: 2; Value: 10uF; Status: Preferred; Manufacturer Part Number: CC0805_10UF_25V_10%_X5R; Case: 0805; Mounted: Yes; Socket: No; SMD: Yes; Sense: No; Manufacturer1 Example: MURATA; Manufacturer1 ComponentHeight: 0.95mm; HelpURL: \\cern.ch\dfs\Applications\Altium\Datasheets\CC0805_X5R_MURATA_GRM.pdf; Author: CERN DEM JLC; CreateDate: 25.10.2012; LatestRevisionDate: 06.09.2016
C20 C22 = CC0402_100NF_16V_10%_X5R: Non-polarised capacitor; Part Description: SMD Multilayer Chip Ceramic Capacitor; Manufacturer: GENERIC; Manufacturer1 Part Number: GRM155R61C104KA88D; Voltage: 16V; TC: X5R; Tolerance: ±10%; Part Number: CC0402_100NF_16V_10%_X5R; Component Kind: Standard; Component Type: Standard; Pin Count: 2; Value: 100nF; Status: None; Manufacturer Part Number: CC0402_100NF_16V_10%_X5R; Case: 0402; Mounted: Yes; Socket: No; SMD: Yes; Sense: No; Manufacturer1 Example: MURATA; Manufacturer1 ComponentHeight: 0.55mm; HelpURL: \\cern.ch\dfs\Applications\Altium\Datasheets\CC0402_X5R_MURATA_GRM.pdf; Author: CERN DEM JLC; CreateDate: 10.12.2013; LatestRevisionDate: 10.12.2013
C75 C76 = CC0805_47NF_25V_5%_C0G: Non-polarised capacitor; Part Description: SMD Multilayer Chip Ceramic Capacitor; Manufacturer: GENERIC; Manufacturer1 Part Number: C0805C473J3GACTU; Voltage: 25V; TC: C0G/NP0; Tolerance: ±5%; Part Number: CC0805_47NF_25V_5%_C0G; Component Kind: Standard; Component Type: Standard; Pin Count: 2; Value: 47nF; Status: None; Manufacturer Part Number: CC0805_47NF_25V_5%_C0G; Case: 0805; Mounted: Yes; Socket: No; SMD: Yes; Sense: No; Manufacturer1 Example: KEMET; Manufacturer1 ComponentHeight: 1.4mm; HelpURL: \\cern.ch\dfs\Applications\Altium\Datasheets\CC0805_C0G_KEMET_(Commercial Grade).pdf; Author: CERN DEM JLC; CreateDate: 18.01.2011; LatestRevisionDate: 18.01.2011
IC1 = LTC6655BHMS8-5#PBF: 0.25ppm Noise, Low Drift Precision Buffered Voltage Reference; Part Description: 5V, 0.25ppm Noise, Low Drift Precision Buffered Voltage Reference; Manufacturer: LINEAR TECHNOLOGY; PressFit: No; Bonding: No; Part Number: LTC6655BHMS8-5#PBF; Component Kind: Standard; Component Type: Standard; Device: LTC6655BHMS8-5#PBF; PackageDescription: SOP, 8-Leads, Body 3.1x3.1mm (max), Pitch 0.65mm, IPC Medium Density; Manufacturer Part Number: LTC6655BHMS8-5#PBF; Pin Count: 8; Case: SSOP8; Mounted: Yes; Socket: No; SMD: Yes; Sense: No; ComponentHeight: 1.1mm; HelpURL: \\cern.ch\dfs\Applications\Altium\Datasheets\LTC6655BHMS8-5#PBF.pdf; Author: CERN DEM JLC; CreateDate: 07.06.2012; LatestRevisionDate: 07.06.2012
IC2 = ADC_LTC2320HUKG-16: Octal, 16-Bit, 1.5Msps/Ch  Simultaneous Sampling ADC; Manufacturer: LINEAR TECHNOLOGY; PressFit: No; Bonding: No; Part Number: LTC2320HUKG-16#PBF; Component Kind: Standard; Component Type: Standard; Device: LTC2320HUKG-16#PBF; PackageDescription: QFN, 52-Leads, Body 7.00x8.00mm, Pitch 0.50mm, Thermal Pad 5.41x6.40mm, IPC Low Density; Part Description: Octal, 16-Bit, 1.5Msps/Ch  Simultaneous Sampling ADC; Manufacturer Part Number: LTC2320HUKG-16#PBF; Pin Count: 48; Case: QFP48; Mounted: Yes; Socket: No; SMD: Yes; Sense: No; ComponentHeight: 0.8; Author: GK; HelpURL: \\cern.ch\dfs\Applications\Altium\Datasheets\LTC2335CLX-18#PBF.pdf; CreateDate: 10.01.2017; LatestRevisionDate: 10.01.2017
IC5 = OA_OPA2197IDGKR: 36-V, Precision, Rail-to-Rail Input Output, Low Offset Voltage Op Amp 8-VSSOP; Part Description: High-Precision, Low-Noise, Rail-to-Rail Output,10-MHz Op Amp; Manufacturer: TEXAS INSTRUMENTS; PressFit: No; Bonding: No; Part Number: OPA2197IDGKR; Component Kind: Standard; Component Type: Standard; Device: OPA2197IDGKR; PackageDescription: SOP, 0.65mm pitch; 8 pin, 3.00mm W X 3.00mm L X 1.10mm H body, IPC Medium Density; Manufacturer Part Number: OPA2197IDGKR; Pin Count: 8; Case: MSOP8; Mounted: Yes; Socket: No; SMD: Yes; Sense: No; ComponentHeight: 1.1mm; Author: GK; HelpURL: \\cern.ch\dfs\Applications\Altium\Datasheets\OPA2140AIDGK.pdf; CreateDate: 20.04.2017; LatestRevisionDate: 20.04.2017
R1 R10 R11 R15 = R0402_0R_JUMPER: Resistor; Part Description: 1A (0.05R Max DC Resistance) Zero Ohm Jumper; Manufacturer: GENERIC; Manufacturer1 Part Number: 232270591001L; Part Number: R0402_0R_JUMPER; Component Kind: Standard; Component Type: Standard; Pin Count: 2; Value: 0; Status: Not recommended; Manufacturer Part Number: R0402_0R_JUMPER; Case: 0402; Mounted: Yes; Sense: No; Socket: No; SMD: Yes; Manufacturer1 Example: YAGEO PHYCOMP; Manufacturer1 ComponentHeight: 0.4mm; HelpURL: \\cern.ch\dfs\Applications\Altium\Datasheets\R0402_Phycomp_RC0402.pdf; Author: CERN DEM JLC; CreateDate: 03.12.2007; LatestRevisionDate: 17.10.2012
R2 = R0603_1K_1%_0.1W_100PPM: Resistor - 1%; Part Description: General Purpose Thick Film Chip Resistor; Manufacturer: GENERIC; Manufacturer1 Part Number: NRC06F1001TRF; Power: 0.1W; TC: ±100ppm/°C; Part Number: R0603_1K_1%_0.1W_100PPM; Component Kind: Standard; Component Type: Standard; Pin Count: 2; Value: 1k; Status: Preferred; Tolerance: ±1%; Manufacturer Part Number: R0603_1K_1%_0.1W_100PPM; Case: 0603; Mounted: Yes; Sense: No; Socket: No; SMD: Yes; Manufacturer1 Example: NIC COMPONENT; Manufacturer1 ComponentHeight: 0.55mm; HelpURL: \\cern.ch\dfs\Applications\Altium\Datasheets\R0603_NIC_NRC.pdf; Author: CERN DEM JLC; CreateDate: 03.12.2007; LatestRevisionDate: 13.03.2008
R9 = R0402_100R_1%_0.1W_100PPM: Resistor - 1%; Part Description: General Purpose Thick Film Chip Resistor; Manufacturer: GENERIC; Manufacturer Part Number: R0402_100R_1%_0.1W_100PPM_50V; Manufacturer1 Part Number: ERJ2RKF1000X; Power: 0.1W; TC: ±100ppm/°C; Voltage: 50V; Part Number: R0402_100R_1%_0.1W_100PPM; Component Kind: Standard; Component Type: Standard; Pin Count: 2; Value: 100; Status: Not recommended; Tolerance: ±1%; Case: 0402; Mounted: Yes; Sense: No; Socket: No; SMD: Yes; Manufacturer1 Example: PANASONIC; Manufacturer1 ComponentHeight: 0.4mm; HelpURL: \\cern.ch\dfs\Applications\Altium\Datasheets\R0402_PANASONIC_ERJ2RK.pdf; Author: CERN DEM JLC; CreateDate: 12.12.2013; LatestRevisionDate: 03.03.2015
RN3 RN4 = RN_10K_5K_VISHAY_AORN2-1AT3: DIL8 Resistor Network 4 Resistors 10k-5k-5k-10k 0.1%; Part Description: Dual-In-Line Thin Film Precision Automotive Resistors Network, (4 Isolated) - AORN Series; Manufacturer: VISHAY DALE; Power: 4x0.1W; TC: ±25ppm/°C; PressFit: No; Part Number: RN_10K_5K_VISHAY_AORN2-1AT3; Component Kind: Standard; Component Type: Standard; Pin Count: 8; Value: 10k 5K 5K 10K; Sense: No; Tolerance: 0.1%; Manufacturer Part Number: AORN2-1AT3; Case: SOIC8; Mounted: Yes; Socket: No; SMD: Yes; ComponentHeight: 1.73mm; HelpURL: \\cern.ch\dfs\Applications\Altium\Datasheets\RN_VISHAY_AORN.pdf; Author: CERN DEM JLC; CreateDate: 20.02.2017; LatestRevisionDate: 20.02.2017
SW2 = SW_CTS_204-121ST: 2x SPST DIP Switch 1NO + 1NF; Part Description: Coupled SPST DIP Switch, 1NO + 1NF, CTS 204 Series; Manufacturer: CTS; PressFit: No; Part Number: SW_CTS_204-121ST; Component Kind: Standard; Component Type: Standard; Pin Count: 4; PackageDescription: Body 7.26 x 9.78mm, 2x SPST DIP, 1NO + 1NF Switch, CTS 204 Series; Family: Switch; Mounted: Yes; Socket: No; SMD: Yes; Sense: No; Status: None; Manufacturer Part Number: 204-121ST; ComponentHeight: 10.36mm; HelpURL: \\cern.ch\dfs\Applications\Altium\Datasheets\SW_CTS_204-121ST.pdf; Author: CERN DEM JLC; CreateDate: 28.08.2014; LatestRevisionDate: 28.08.2014
T9 = BSS138LT1G: as T1 on sheet Sampler; Part Number: BSS138LT1G; Component Kind: Standard; Component Type: Standard; Device: BSS138LT1G; PackageDescription: SOT23 3-Leads, Pitch 0.95mm - Body 1.4x3mm, IPC Medium Density; Manufacturer Part Number: BSS138LT1G; Pin Count: 3; Case: SOT23-3; Mounted: Yes; Socket: No; SMD: Yes; Sense: No; ComponentHeight: 1.11mm; HelpURL: \\cern.ch\dfs\Applications\Altium\Datasheets\BSS138LT1G.pdf; Author: CERN DEM JLC; CreateDate: 23.03.2009; LatestRevisionDate: 23.03.2009

## Sheet LVDS_IFCA.SchDoc: LVDS Interface
size 420 x 297 mm; Author: G.K.; CompanyName: WUT; DrawnBy: G.K.; Organization: CERN; Address1: Warsaw Univeristy of Technology; Address2: Nowowiejska 15/19; DocumentNumber: 4; Revision: -; SheetNumber: 4; SheetTotal: 5; EDA_Number: ARTIQ; Projet: Sampler; ModifiedBy: -; CreateDate: XX/XX/XXXX; CheckedDate: -; Title2: I2C logic v2.0; DivGrp: ISE; Designer: G.K.; ModifiedDate: -; ProjectName: Sampler
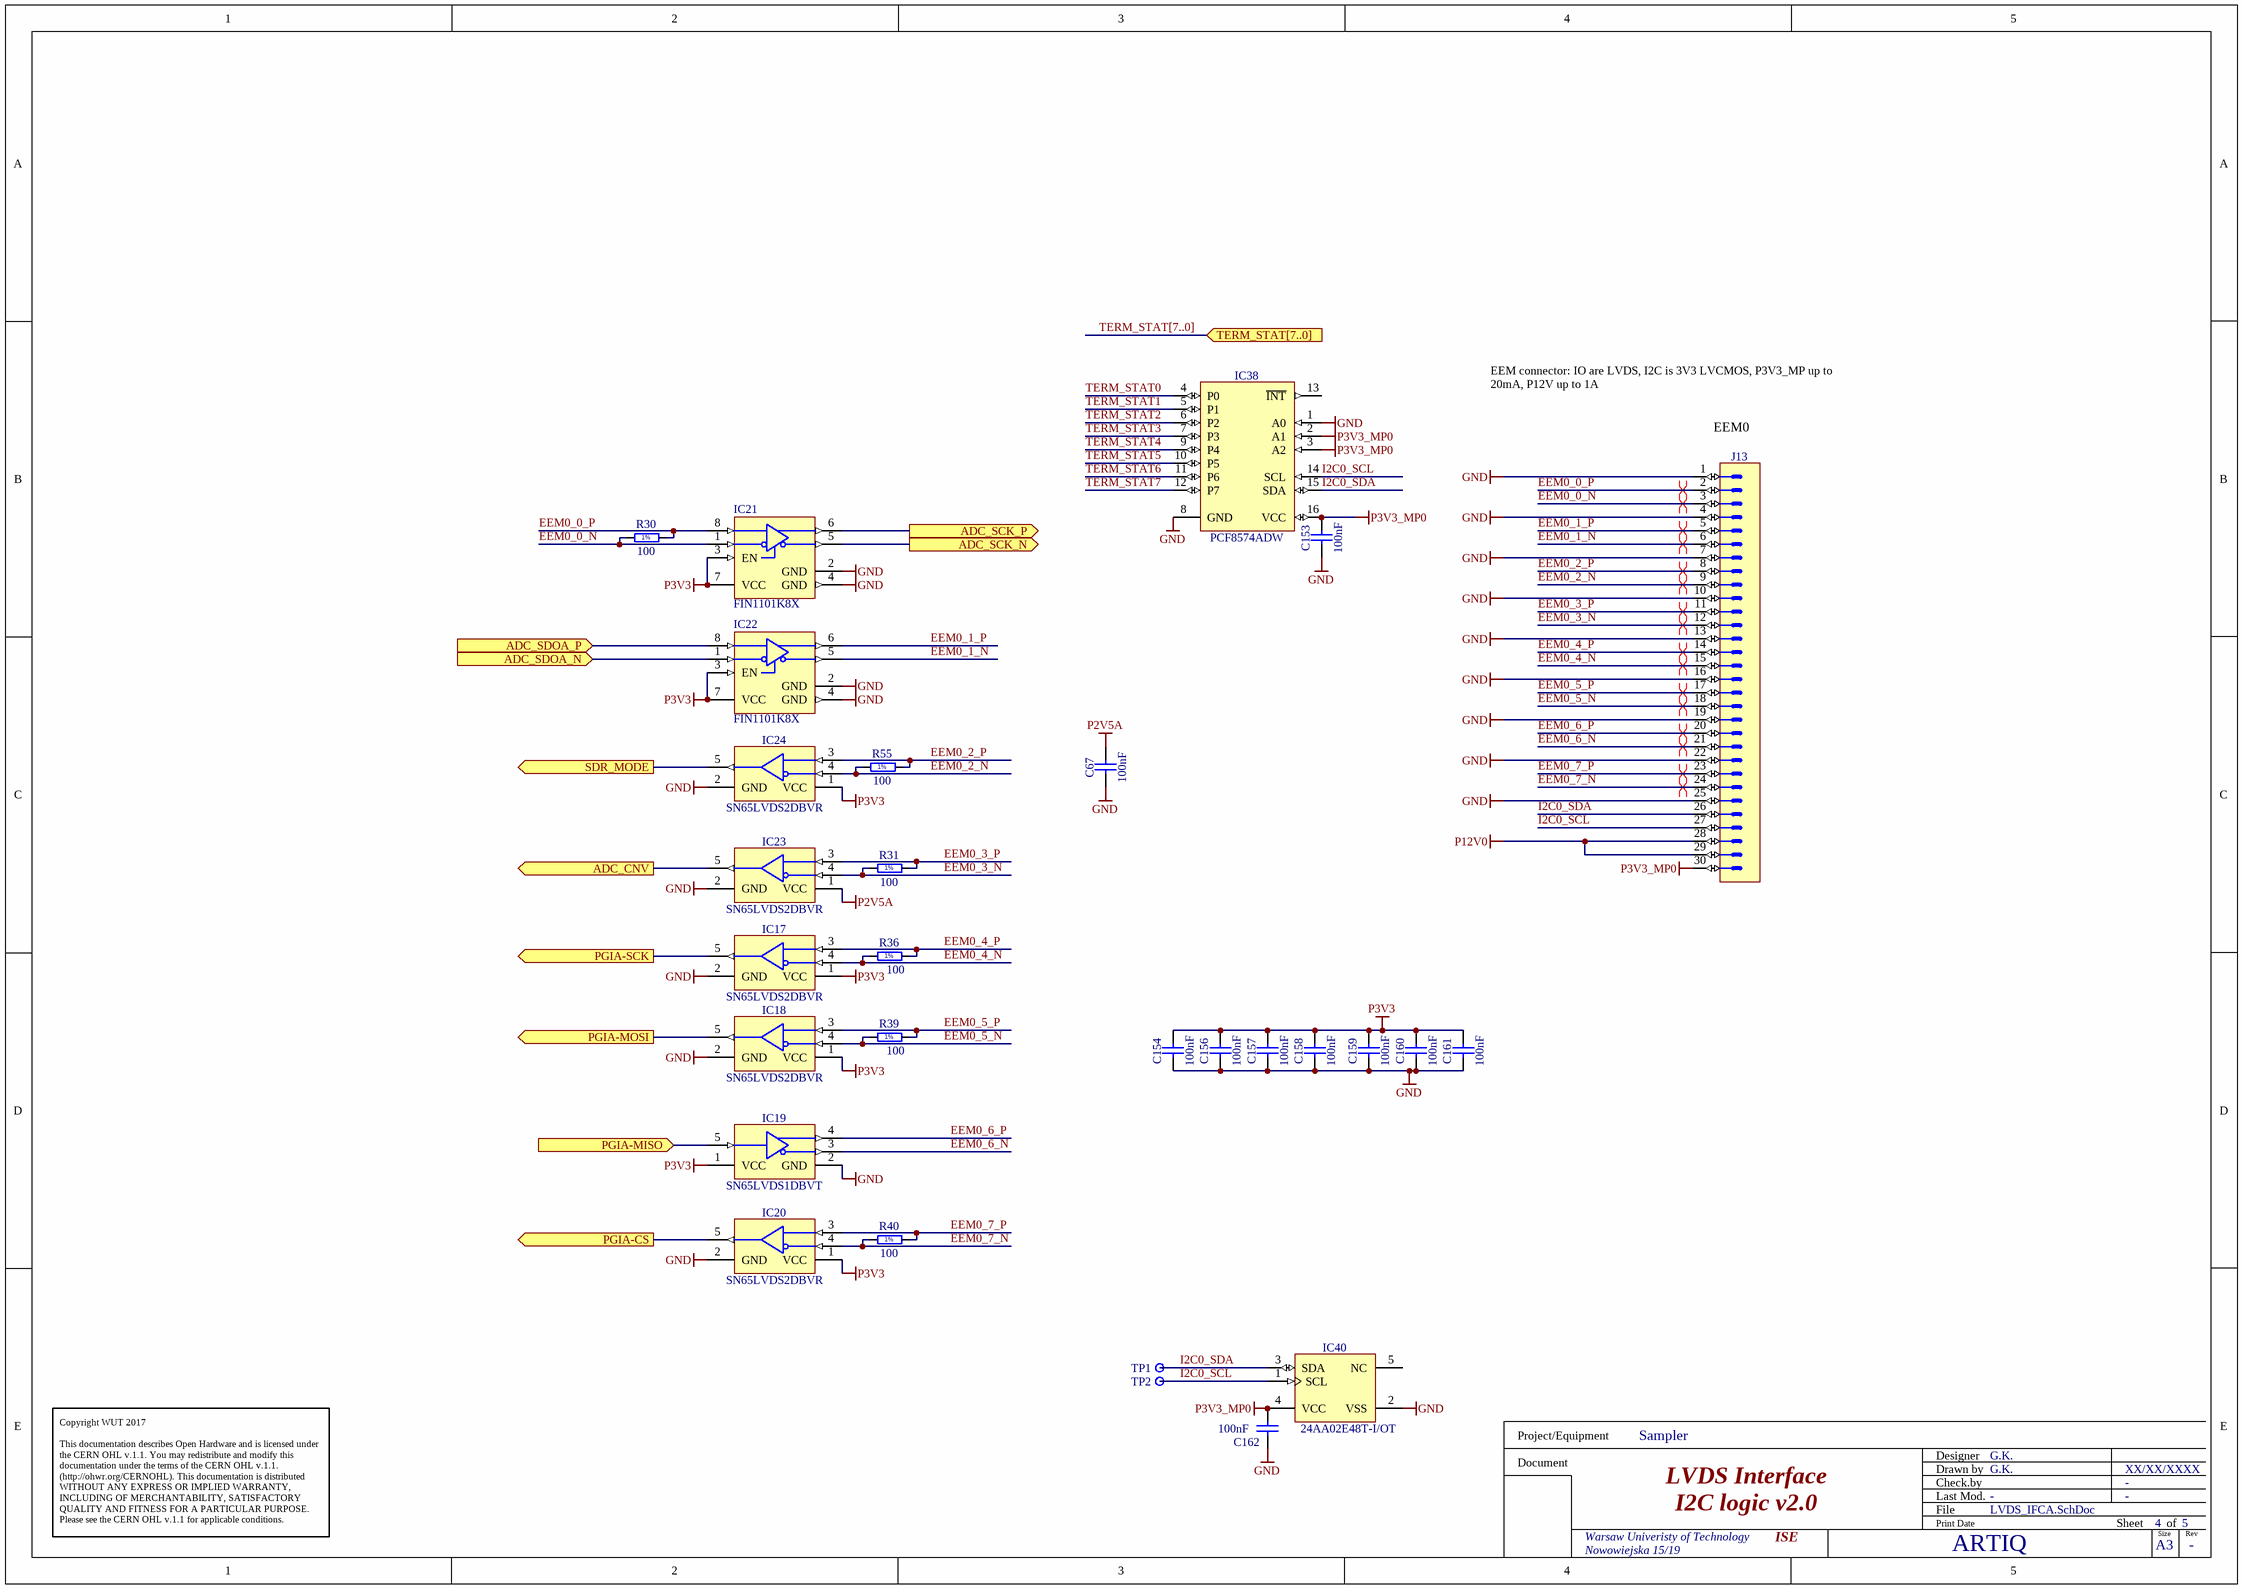
[diagram p2: LVDS_IFCA.SchDoc]

### Parts
C67  100nF  [CAPC1005X55N]
C153  100nF  [CAPC1005X55N]
C154  100nF  [CAPC1005X55N]
C156  100nF  [CAPC1005X55N]
C157  100nF  [CAPC1005X55N]
C158  100nF  [CAPC1005X55N]
C159  100nF  [CAPC1005X55N]
C160  100nF  [CAPC1005X55N]
C161  100nF  [CAPC1005X55N]
C162  100nF  [CAPC1005X55N]
IC17  SN65LVDS2DBVR  [SOT95P280X145-5N]
IC18  SN65LVDS2DBVR  [SOT95P280X145-5N]
IC19  SN65LVDS1DBVT  [SOT95P280X145-5N]
IC20  SN65LVDS2DBVR  [SOT95P280X145-5N]
IC21  FIN1101K8X  [SOP50P310X90-8N]
IC22  FIN1101K8X  [SOP50P310X90-8N]
IC23  SN65LVDS2DBVR  [SOT95P280X145-5N]
IC24  SN65LVDS2DBVR  [SOT95P280X145-5N]
IC38  PCF8574ADW  [SOIC127P1030X265-16N]
IC40  24AA02E48T-I/OT  [SOT95P280X145-5N]
J13  (no value)  [3M_N2530-6002RB]
R30  100  [RESC1005X40N]
R31  100  [RESC1005X40N]
R36  100  [RESC1005X40N]
R39  100  [RESC1005X40N]
R40  100  [RESC1005X40N]
R55  100  [RESC1005X40N]
TP1  Test Point  [TPS127]  (value not drawn)
TP2  Test Point  [TPS127]  (value not drawn)

### Ports
ADC_CNV (out), ADC_SCK_N (out), ADC_SCK_P (out), ADC_SDOA_N (in), ADC_SDOA_P (in), PGIA-CS (out), PGIA-MISO (in), PGIA-MOSI (out), PGIA-SCK (out), SDR_MODE (out), TERM_STAT[7..0] (in)

### Nets
GND: C67.1 C153.1 C154.1 C156.1 C157.1 C158.1 C159.1 C160.1 C161.1 C162.1 IC17.2(GND) IC18.2(GND) IC19.2(GND) IC20.2(GND) IC21.2(GND) IC21.4(GND) IC22.2(GND) IC22.4(GND) IC23.2(GND) IC24.2(GND) IC38.1(A0) IC38.8(GND) IC40.2(VSS) J13.1 J13.4 J13.7 J13.10 J13.13 J13.16 J13.19 J13.22 J13.25
P2V5A: C67.2 IC23.1(VCC)
P3V3: C154.2 C156.2 C157.2 C158.2 C159.2 C160.2 C161.2 IC17.1(VCC) IC18.1(VCC) IC19.1(VCC) IC20.1(VCC) IC21.3(EN) IC21.7(VCC) IC22.3(EN) IC22.7(VCC) IC24.1(VCC)
P3V3_MP0: C153.2 C162.2 IC38.2(A1) IC38.3(A2) IC38.16(VCC) IC40.4(VCC) J13.30
P12V0: J13.28 J13.29
ADC_SCK_N: IC21.5(DOUT-) ; port ADC_SCK_N
ADC_SCK_P: IC21.6(DOUT+) ; port ADC_SCK_P
ADC_SDOA_N: IC22.1(RIN-) ; port ADC_SDOA_N
ADC_SDOA_P: IC22.8(RIN+) ; port ADC_SDOA_P
EEM0_0_N: IC21.1(RIN-) J13.3 R30.1
EEM0_0_P: IC21.8(RIN+) J13.2 R30.2
EEM0_1_N: IC22.5(DOUT-) J13.6
EEM0_1_P: IC22.6(DOUT+) J13.5
EEM0_2_N: IC24.4(B) J13.9 R55.1
EEM0_2_P: IC24.3(A) J13.8 R55.2
EEM0_3_N: IC23.4(B) J13.12 R31.1
EEM0_3_P: IC23.3(A) J13.11 R31.2
EEM0_4_N: IC17.4(B) J13.15 R36.1
EEM0_4_P: IC17.3(A) J13.14 R36.2
EEM0_5_N: IC18.4(B) J13.18 R39.1
EEM0_5_P: IC18.3(A) J13.17 R39.2
EEM0_6_N: IC19.3(A) J13.21
EEM0_6_P: IC19.4(B) J13.20
EEM0_7_N: IC20.4(B) J13.24 R40.1
EEM0_7_P: IC20.3(A) J13.23 R40.2
I2C0_SCL: IC38.14(SCL) IC40.1(SCL) J13.27 TP2.1
I2C0_SDA: IC38.15(SDA) IC40.3(SDA) J13.26 TP1.1
PGIA-CS: IC20.5(R) ; port PGIA-CS
PGIA-MISO: IC19.5(R) ; port PGIA-MISO
PGIA-MOSI: IC18.5(R) ; port PGIA-MOSI
PGIA-SCK: IC17.5(R) ; port PGIA-SCK
TERM_STAT0: IC38.4(P0)
TERM_STAT1: IC38.5(P1)
TERM_STAT2: IC38.6(P2)
TERM_STAT3: IC38.7(P3)
TERM_STAT4: IC38.9(P4)
TERM_STAT5: IC38.10(P5)
TERM_STAT6: IC38.11(P6)
TERM_STAT7: IC38.12(P7)
NetIC2_24: IC23.5(R) ; port ADC_CNV
NetIC24_5: IC24.5(R) ; port SDR_MODE

Not connected (* = marked no-connect by the designer): IC38 13(~{INT}); IC40 5(NC)

### Buses and harness runs
bus TERM_STAT[7..0] = port TERM_STAT[7..0]

### Layout directives
differential pair: EEM0_0_N, EEM0_0_P, EEM0_1_N, EEM0_1_P, EEM0_2_N, EEM0_2_P, EEM0_3_N, EEM0_3_P, EEM0_4_N, EEM0_4_P, EEM0_5_N, EEM0_5_P, EEM0_6_N, EEM0_6_P, EEM0_7_N, EEM0_7_P

### Notes on the sheet
- (near J13) EEM connector: IO are LVDS, I2C is 3V3 LVCMOS, P3V3_MP up to 20mA, P12V up to 1A
- (near J13) EEM0
- Copyright WUT 2017
  This documentation describes Open Hardware and is licensed under the CERN OHL v.1.1. You may redistribute and modify this documentation under the terms of the CERN OHL v.1.1. (http://ohwr.org/CERNOHL). This documentation is distributed WITHOUT ANY EXPRESS OR IMPLIED WARRANTY, INCLUDING OF MERCHANTABILITY, SATISFACTORY QUALITY AND FITNESS FOR A PARTICULAR PURPOSE. Please see the CERN OHL v.1.1 for applicable conditions.
- Project/Equipment
- Document
- Designer
- Drawn by
- Check.by
- File
- Last Mod.
- Print Date
- Sheet
- Size
- A3
- of
- Rev
- (in symbol R0402_100R_1%_0.1W_100PPM) 1%

### Library data of the parts
C67 C153 C154 C156-C162 = CC0402_100NF_16V_10%_X5R: as C20 on sheet ADC_8CH; Part Number: CC0402_100NF_16V_10%_X5R; Component Kind: Standard; Component Type: Standard; Pin Count: 2; Value: 100nF; Status: None; Manufacturer Part Number: CC0402_100NF_16V_10%_X5R; Case: 0402; Mounted: Yes; Socket: No; SMD: Yes; Sense: No; Manufacturer1 Example: MURATA; Manufacturer1 ComponentHeight: 0.55mm; HelpURL: \\cern.ch\dfs\Applications\Altium\Datasheets\CC0402_X5R_MURATA_GRM.pdf; Author: CERN DEM JLC; CreateDate: 10.12.2013; LatestRevisionDate: 10.12.2013
IC17 IC18 IC20 IC23 IC24 = SN65LVDS2DBVR: High-Speed Differential Line Receiver; Manufacturer: TEXAS INSTRUMENTS; PressFit: No; Bonding: No; Part Number: SN65LVDS2DBVR; Component Kind: Standard; Component Type: Standard; Device: SN65LVDS2DBVR; PackageDescription: SOT, 0.95mm pitch; 5 pin, 1.60mm W X 2.90mm L X 1.45mm H body, IPC Medium Density; Part Description: High-Speed Differential Line Receiver; Manufacturer Part Number: SN65LVDS2DBVR; Pin Count: 5; Case: SOT23-5; Mounted: Yes; Socket: No; SMD: Yes; Sense: No; ComponentHeight: 1.45mm; Author: CERN DEM JLC; HelpURL: \\cern.ch\dfs\Applications\Altium\Datasheets\SN65LVDS2DBVR.pdf; CreateDate: 03.03.2011; LatestRevisionDate: 22.09.2011
IC19 = SN65LVDS1DBVT: High-Speed Differential Line Driver; Manufacturer: TEXAS INSTRUMENTS; PressFit: No; Bonding: No; Part Number: SN65LVDS1DBVT; Component Kind: Standard; Component Type: Standard; Device: SN65LVDS1DBVT; PackageDescription: SOT, 0.95mm pitch; 5 pin, 1.60mm W X 2.90mm L X 1.45mm H body, IPC Medium Density; Part Description: High-Speed Differential Line Driver; Manufacturer Part Number: SN65LVDS1DBVT; Pin Count: 5; Case: SOT23-5; Mounted: Yes; Socket: No; SMD: Yes; Sense: No; ComponentHeight: 1.45mm; Author: CERN DEM JLC; HelpURL: \\cern.ch\dfs\Applications\Altium\Datasheets\SN65LVDS1DBVT.pdf; CreateDate: 22.09.2011; LatestRevisionDate: 22.09.2011
IC21 IC22 = FIN1101K8X: LVDS Single Port High Speed Repeater; Manufacturer: FAIRCHILD SEMICONDUCTOR; PressFit: No; Bonding: No; Part Number: FIN1101K8X; Component Kind: Standard; Component Type: Standard; Device: FIN1101K8X; PackageDescription: SOP, 0.50mm Pitch; 8 pin, 2.30mm W X 2.00mm L X 0.90mm H body, PC Medium Density; Part Description: LVDS Single Port High Speed Repeater; Manufacturer Part Number: FIN1101K8X; Pin Count: 8; Case: TSSOP8; Mounted: Yes; Socket: No; SMD: Yes; Sense: No; ComponentHeight: 0.8mm; Author: CERN DEM JLC; HelpURL: \\cern.ch\dfs\Applications\Altium\Datasheets\FIN1101K8X.pdf; CreateDate: 08.11.2016; LatestRevisionDate: 08.11.2016
IC38 = PCF8574ADW: Remote 8-bit I/O Expander For I2C Bus; Manufacturer: TEXAS INSTRUMENTS; PressFit: No; Bonding: No; Part Number: PCF8574ADW; Component Kind: Standard; Component Type: Standard; Device: PCF8574ADW; PackageDescription: SOIC 16, Pitch 1.27mm - Body 7.5x10.3mm, IPC Medium Density; Part Description: Remote 8-bit I/O Expander For I2C Bus; Manufacturer Part Number: PCF8574ADW; Pin Count: 16; Case: SOIC16W; Mounted: Yes; Socket: No; SMD: Yes; Sense: No; ComponentHeight: 2.65mm; Author: CERN DEM JLC; HelpURL: \\cern.ch\dfs\Applications\Altium\Datasheets\PCF8574ADW.pdf; CreateDate: 01.11.2012; LatestRevisionDate: 01.11.2012
IC40 = 24AA02E48T-I/OT: 1.7V-5.5V, 2K I2C Serial EEPROM With EUI-48 Node Identity; Manufacturer: MICROCHIP TECHNOLOGY; PressFit: No; Bonding: No; Part Number: 24AA02E48T-I/OT; Component Kind: Standard; Component Type: Standard; Device: 24AA02E48T-I/OT; PackageDescription: SOT, 0.95mm pitch; 5 pin, 1.60mm W X 2.90mm L X 1.45mm H body, IPC Medium Density; Part Description: 1.7V-5.5V, 2K I2C Serial EEPROM With EUI-48 Node Identity; Manufacturer Part Number: 24AA02E48T-I/OT; Pin Count: 5; Case: SOT23-5; Mounted: Yes; Socket: No; SMD: Yes; Sense: No; ComponentHeight: 1.45mm; HelpURL: \\cern.ch\dfs\Applications\Altium\Datasheets\24AA02E48T-I-OT.pdf; Author: CERN DEM MR; CreateDate: 31.03.2016; LatestRevisionDate: 31.03.2016
J13 = 3M_N2530-6002RB: Connector 30 Male; Part Description: 30 Contacts - Straight .100'' x .100'' Low Profile Four-Wall Header, 2500 Series; Manufacturer: 3M; PressFit: No; Part Number: 3M_N2530-6002RB; Component Kind: Standard; Component Type: Standard; Pin Count: 30; Family: Header 30; Mounted: Yes; Socket: No; SMD: No; Sense: No; Status: None; Manufacturer Part Number: N2530-6002RB; ComponentHeight: 10.03mm; HelpURL: \\cern.ch\dfs\Applications\Altium\Datasheets\3M_N2530-6002RB.pdf; Author: CERN DEM JLC; CreateDate: 11.02.2009; LatestRevisionDate: 11.08.2009
R30 R31 R36 R39 R40 R55 = R0402_100R_1%_0.1W_100PPM: as R9 on sheet ADC_8CH; Part Number: R0402_100R_1%_0.1W_100PPM; Component Kind: Standard; Component Type: Standard; Pin Count: 2; Value: 100; Status: Not recommended; Tolerance: ±1%; Case: 0402; Mounted: Yes; Sense: No; Socket: No; SMD: Yes; Manufacturer1 Example: PANASONIC; Manufacturer1 ComponentHeight: 0.4mm; HelpURL: \\cern.ch\dfs\Applications\Altium\Datasheets\R0402_PANASONIC_ERJ2RK.pdf; Author: CERN DEM JLC; CreateDate: 12.12.2013; LatestRevisionDate: 03.03.2015
TP1 TP2 = SMD_PAD_1.27X1.27MM: Part Description: 1.27mm x 1.27mm PCB Copper Area (SMD Test Point); Mounted: No; Part Number: SMD_PAD_1.27X1.27MM; Component Kind: Standard (No BOM); Component Type: Standard (No BOM); Pin Count: 1; Family: Test Point; Socket: No; SMD: Yes; Sense: No; Status: None; ComponentHeight: 0mm; HelpURL: Undefined; Author: CERN DEM JLC; CreateDate: 12.01.2008; LatestRevisionDate: 12.01.2008; PackageDescription: 1.27mm x 1.27mm PCB Copper Area (SMD Test Point)